# Altium project BG1094_R1M1E1.PrjPcb (part 1 of 2)
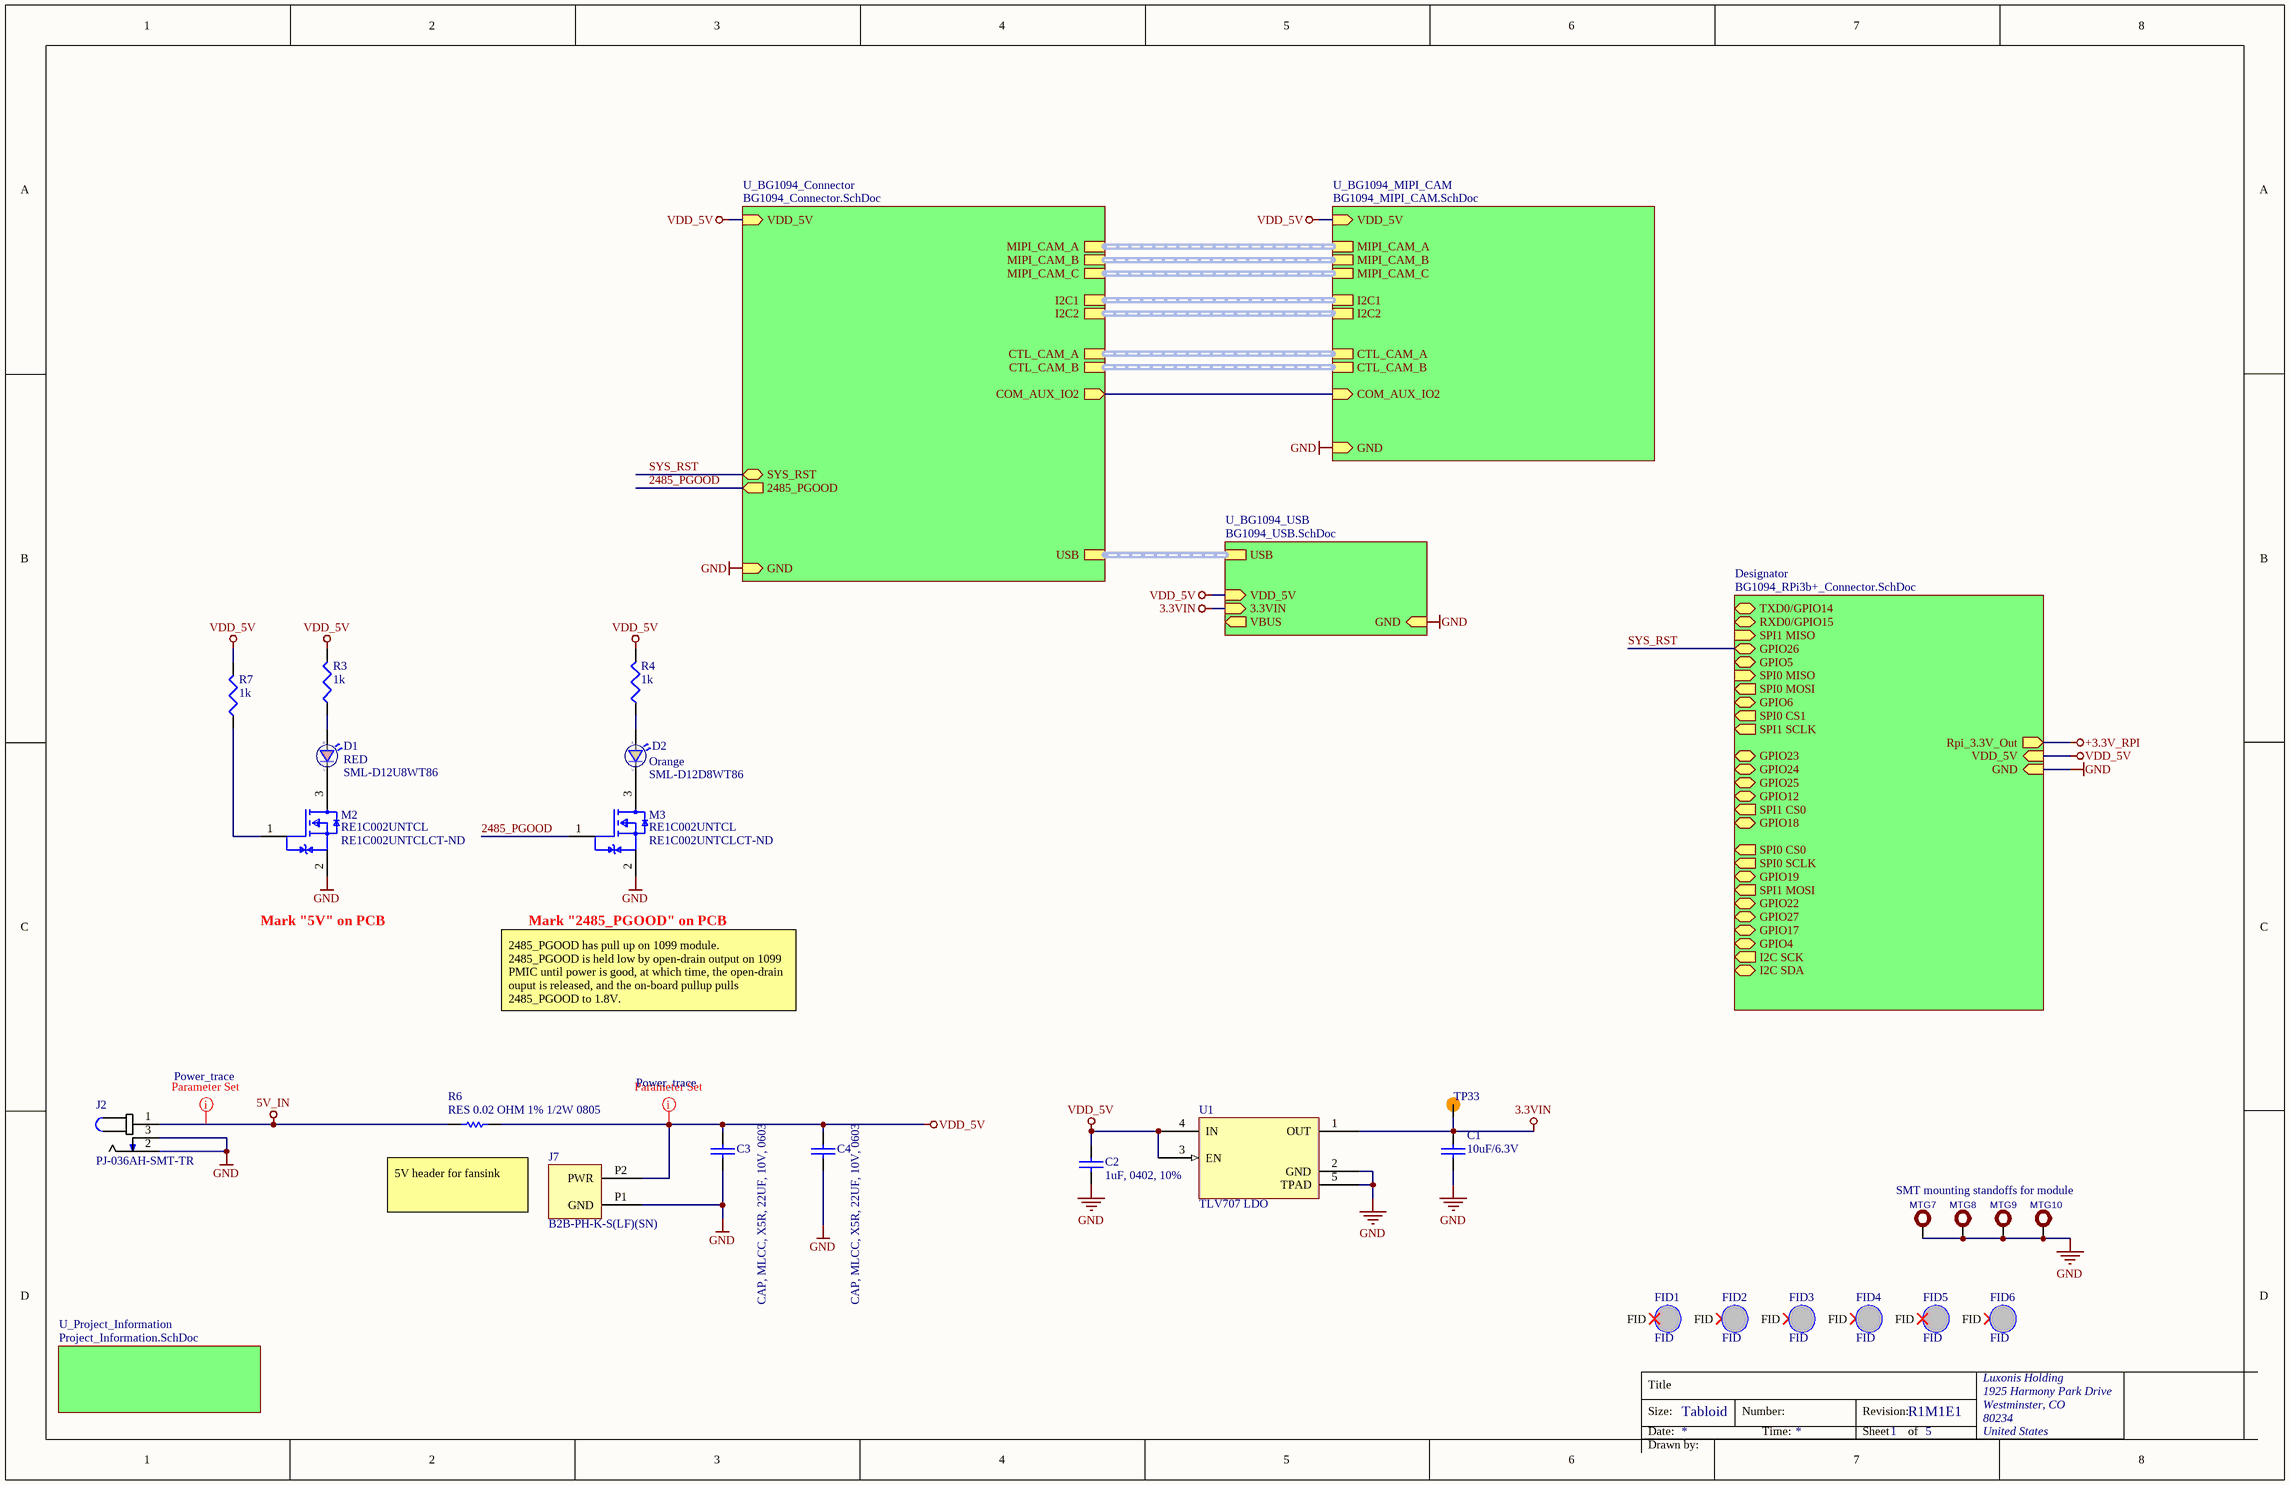
[diagram p0: BG1094_TopLevel.SchDoc]
document_number: D0000194; drawn_by: Brian Weinstein; project_title: BW1094; revision: R1M1E1
6 sheets, 84 parts. Net scope: strictly hierarchical (ports join the sheet entries above them; power ports are local).
Board file: BG1094.PcbDoc
Sheets:
  BG1094_TopLevel.SchDoc
    U_BG1094_Connector = BG1094_Connector.SchDoc
    U_BG1094_MIPI_CAM = BG1094_MIPI_CAM.SchDoc
    U_BG1094_USB = BG1094_USB.SchDoc
    Designator = BG1094_RPi3b+_Connector.SchDoc
    U_Project_Information = Project_Information.SchDoc

## Sheet BG1094_TopLevel.SchDoc: =project_title
size Tabloid; PageSetup: Record=PageOptions|CenterHorizontal=True|CenterVertical=True|PrintScale=0.73|XCorrection=1.00|YCorrection=1.00|PrintKind=0|BorderSize=5000000|LeftOffset=0|BottomOffset=0|Orientation=2|PaperLength=1000|PaperWidth=1000|Scale=100|PaperSource=7|PrintQuality=-4|MediaType=1|DitherType=10|PaperKind=A4|PrintScaleMode=1; CompanyName: Luxonis Holding; DrawnBy: Brian Weinstein; Organization: Luxonis Holding; Address1: 1925 Harmony Park Drive; Address2: Westminster, CO; Address3: 80234; Address4: United States; DocumentNumber: D0000194; Revision: R1M1E1; SheetNumber: 1; SheetTotal: 5

### Parts
C1  10uF/6.3V  [CAPC0402(1005)70_N]
C2  1uF, 0402, 10%  [CAPC0402(1005)70_N]
C3  CAP, MLCC, X5R, 22UF, 10V, 0603  [CAPC0603(1608)100_N]
C4  CAP, MLCC, X5R, 22UF, 10V, 0603  [CAPC0603(1608)100_N]
D1  RED  Manufacturer Part Number 1: SML-D12U8WT86  [LED_0603]
D2  SML-D12D8WT86  Color: Orange  [LED_0603]
FID1  FID  [FIDUCIAL_1MM]  (no BOM)
FID2  FID  [FIDUCIAL_1MM]  (no BOM)
FID3  FID  [FIDUCIAL_1MM]  (no BOM)
FID4  FID  [FIDUCIAL_1MM]  (no BOM)
FID5  FID  [FIDUCIAL_1MM]  (no BOM)
FID6  FID  [FIDUCIAL_1MM]  (no BOM)
J2  PJ-036AH-SMT-TR  [CUI_PJ-036AH-SMT-TR]
J7  B2B-PH-K-S(LF)(SN)  [*JST_B2B-PH-K-S(LF)(SN)]
M2  RE1C002UNTCL  Supplier Part Number 1: RE1C002UNTCLCT-ND  [SOT-416FL]
M3  RE1C002UNTCL  Supplier Part Number 1: RE1C002UNTCLCT-ND  [SOT-416FL]
MTG7  MTG-HOLE  [STANDOFF_M2X0.4_3MM]  (value not drawn)
MTG8  MTG-HOLE  [STANDOFF_M2X0.4_3MM]  (value not drawn)
MTG9  MTG-HOLE  [STANDOFF_M2X0.4_3MM]  (value not drawn)
MTG10  MTG-HOLE  [STANDOFF_M2X0.4_3MM]  (value not drawn)
R3  1k  [RESC0402(1005)_N]
R4  1k  [RESC0402(1005)_N]
R6  RES 0.02 OHM 1% 1/2W 0805  [RESC0805(2012)_M]
R7  1k  [RESC0402(1005)_N]
TP33  TP_SMD  [TP_0.75MM_SMD_NO-SILK]  (value not drawn)  (no BOM)
U1  TLV707 LDO  [DFN65P100X40-4L]

### Sub-sheets
Designator = BG1094_RPi3b+_Connector.SchDoc: SPI1 MISO (in), GPIO26 (bidir), GPIO5 (bidir), SPI0 MISO (in), SPI0 MOSI (out), GPIO6 (bidir), SPI0 CS1 (out), SPI1 SCLK (out), GPIO23 (bidir), GPIO24 (bidir), GPIO25 (bidir), GPIO12 (bidir), SPI1 CS0 (out), GPIO18 (bidir), SPI0 CS0 (out), SPI0 SCLK (out), GPIO19 (bidir), SPI1 MOSI (out), GPIO22 (bidir), GPIO27 (bidir), GPIO17 (bidir), GPIO4 (bidir), I2C SCK (out), I2C SDA (bidir), Rpi_3.3V_Out (out), VDD_5V (in), GND (in), RXD0/GPIO15 (bidir), TXD0/GPIO14 (bidir)
U_BG1094_Connector = BG1094_Connector.SchDoc: MIPI_CAM_B (harness MIPI_CAM_B), MIPI_CAM_A (harness MIPI_CAM_A), MIPI_CAM_C (harness MIPI_CAM_C), I2C2 (harness I2C2), I2C1 (harness I2C1), SYS_RST (bidir), CTL_CAM_A (harness CTL_CAM_A), CTL_CAM_B (harness CTL_CAM_B), USB (harness USB), GND (in), VDD_5V (in), 2485_PGOOD (out), COM_AUX_IO2 (out)
U_BG1094_MIPI_CAM = BG1094_MIPI_CAM.SchDoc: MIPI_CAM_B (harness MIPI_CAM_B), I2C2 (harness I2C2), I2C1 (harness I2C1), MIPI_CAM_A (harness MIPI_CAM_A), MIPI_CAM_C (harness MIPI_CAM_C), CTL_CAM_A (harness CTL_CAM_A), CTL_CAM_B (harness CTL_CAM_B), GND (in), VDD_5V (in), COM_AUX_IO2 (in)
U_BG1094_USB = BG1094_USB.SchDoc: USB (harness USB), VBUS (out), GND (in), VDD_5V (in), 3.3VIN (in)
U_Project_Information = Project_Information.SchDoc: no entries

### Nets
3.3VIN: C1.2 TP33.1 U1.1(OUT) ; sheet U_BG1094_USB/3.3VIN
5V_IN: J2.1 R6.2
+3.3V_RPI: sheet Designator/Rpi_3.3V_Out
GND: C1.1 C2.2 C3.2 C4.2 J2.2 J2.3 J7.P1(GND) M2.2(Source) M3.2(Source) MTG7.1 MTG8.1 MTG9.1 MTG10.1 U1.2(GND) U1.5(TPAD) ; sheet U_BG1094_Connector/GND, sheet U_BG1094_MIPI_CAM/GND, sheet U_BG1094_USB/GND, sheet Designator/GND
VDD_5V: C2.1 C3.1 C4.1 J7.P2(PWR) R3.2 R4.2 R6.1 R7.2 U1.3(EN) U1.4(IN) ; sheet U_BG1094_Connector/VDD_5V, sheet U_BG1094_MIPI_CAM/VDD_5V, sheet U_BG1094_USB/VDD_5V, sheet Designator/VDD_5V
2485_PGOOD: M3.1(Gate) ; sheet U_BG1094_Connector/2485_PGOOD
COM_AUX_IO2: sheet U_BG1094_Connector/COM_AUX_IO2, sheet U_BG1094_MIPI_CAM/COM_AUX_IO2
SYS_RST: sheet U_BG1094_Connector/SYS_RST, sheet Designator/GPIO26
NetD1_1: D1.1(C) M2.3(Drain)
NetD1_2: D1.2(A) R3.1
NetD2_1: D2.1(C) M3.3(Drain)
NetD2_2: D2.2(A) R4.1
NetM2_1: M2.1(Gate) R7.1

Not connected (* = marked no-connect by the designer): FID1 FID*; FID2 FID*; FID3 FID*; FID4 FID*; FID5 FID*; FID6 FID*

### Buses and harness runs
harness sheet U_BG1094_Connector/CTL_CAM_A = sheet U_BG1094_MIPI_CAM/CTL_CAM_A
harness sheet U_BG1094_Connector/CTL_CAM_B = sheet U_BG1094_MIPI_CAM/CTL_CAM_B
harness sheet U_BG1094_Connector/I2C1 = sheet U_BG1094_MIPI_CAM/I2C1
harness sheet U_BG1094_Connector/I2C2 = sheet U_BG1094_MIPI_CAM/I2C2
harness sheet U_BG1094_Connector/MIPI_CAM_A = sheet U_BG1094_MIPI_CAM/MIPI_CAM_A
harness sheet U_BG1094_Connector/MIPI_CAM_B = sheet U_BG1094_MIPI_CAM/MIPI_CAM_B
harness sheet U_BG1094_Connector/MIPI_CAM_C = sheet U_BG1094_MIPI_CAM/MIPI_CAM_C
harness sheet U_BG1094_Connector/USB = sheet U_BG1094_USB/USB

### Layout directives
net class Power_trace: 5V_IN, VDD_5V

### Notes on the sheet
- Mark "5V" on PCB
- Mark "2485_PGOOD" on PCB
- 2485_PGOOD has pull up on 1099 module. 2485_PGOOD is held low by open-drain output on 1099 PMIC until power is good, at which time, the open-drain ouput is released, and the on-board pullup pulls 2485_PGOOD to 1.8V.
- (near R6) 5V header for fansink
- SMT mounting standoffs for module
- Title
- Size:
- Date:
- Tabloid
- Number:
- Time:
- Revision:
- Sheet
- of
- Drawn by:

### Library data of the parts
C1 = CAP: SMD Multilayer Ceramic Capacitor, 0402 [1005 Metric], 10 µF, 6.3 V, ± 20%, X5R; MAN: MuRata; MAN PN: GRM155R60J106ME44D; ICCO PN: MV226007; DIST: Farnell; DIST PN: 2218854RL
C2 = CL05A105KP5NNNC: Cap Ceramic 1uF 10V X5R 10% SMD 0402 85C Paper T/R; Manufacturer: Samsung; Supplier 1: Digi-Key; Manufacturer Part Number: CL05A105KP5NNNC; Stock 1: 13690251; Pricing 1: 1 = 0.10000, 10 = 0.04200, 100 = 0.01880, 500 = 0.01340, 1000 = 0.01053, 2500 = 0.00958, 5000 = 0.00881 (USD); RoHS: Yes; Mount: Surface Mount; Case/Package: 0402; Case Code (Metric): 1005; Case Code (Imperial): 0402; Material: Ceramic; Contact Plating: Tin; Min Operating Temperature: -55°C; Max Operating Temperature: 85°C; Capacitance: 1uF; Tolerance: 10%; Packaging: Tape and Reel; Voltage Rating: 10V; Dielectric: X5R; Package Quantity: 1; Length: 1mm; Height: 0.5mm; Width: 0.02inch; Thickness: 0.022inch; Depth: 0.5mm; Radiation Hardening: No; ComponentLink1URL: https://datasheet.ciiva.com/15195/getdatasheetpartid-358390-15195630.pdf?src-supplier=Verical; ComponentLink1Description: https://datasheet.ciiva.com/15195/getdatasheetpartid-358390-15195630.pdf?src-supplier=Verical; ComponentLink2URL: https://datasheet.ciiva.com/29198/459159-da-01-en-vs-kondensator-0402-29198341.pdf?src-supplier=Conrad; ComponentLink2Description: https://datasheet.ciiva.com/29198/459159-da-01-en-vs-kondensator-0402-29198341.pdf?src-supplier=Conrad
C3 C4 = GRM188R61A226ME15D: Manufacturer 1: *
D1 = LED_RED_0603: LED RED DIFFUSED 0603 SMD; Manufacturer 1: Rohm; Lens Style: Rectangular,Diffused,Colorless; Forward Current: 20mA; Forward Voltage: 2.2V; Luminous Intensity: 63mcd; Dominant Wavelength: 620nm; Number of LEDs: 1; Viewing Angle: 160°; Lens Color: White,Clear,Diffused; Supplier 1: Digi-Key; Stock 1: 34516; Pricing 1: 1=0.33000, 10=0.23900, 100=0.11340, 500=0.07560, 1000=0.05922 (USD); Mount: Surface Mount; Case/Package: 0603; Number of Pins: 2; Case Code (Metric): 1608; Case Code (Imperial): 0603; Min Operating Temperature: -40°C; Max Operating Temperature: 85°C; Packaging: Tape and Reel; Wavelength: 620nm; Package Quantity: 1; Test Current: 20mA; Lens Transparency: Diffused; Length: 1.6mm; Height: 0.65mm; Width: 0.8mm; Radiation Hardening: No; REACH SVHC: No SVHC; Lead Free: Lead Free; ComponentLink1URL: https://datasheet.ciiva.com/11774/0900766b80df3ada-11774020.pdf?src-supplier=RSComponents; ComponentLink1Description: https://datasheet.ciiva.com/11774/0900766b80df3ada-11774020.pdf?src-supplier=RSComponents; ComponentLink2URL: https://datasheet.ciiva.com/2110/sml-d1-2110375.pdf?src-supplier=Digi-Key; ComponentLink2Description: https://datasheet.ciiva.com/2110/sml-d1-2110375.pdf?src-supplier=Digi-Key; ComponentLink3URL: https://datasheet.ciiva.com/2110/sml-d1-2110376.pdf?src-supplier=Digi-Key; ComponentLink3Description: https://datasheet.ciiva.com/2110/sml-d1-2110376.pdf?src-supplier=Digi-Key; ComponentLink4URL: https://datasheet.ciiva.com/2110/sml-d1-2110377.pdf?src-supplier=Digi-Key; ComponentLink4Description: https://datasheet.ciiva.com/2110/sml-d1-2110377.pdf?src-supplier=Digi-Key; ComponentLink5URL: https://datasheet.ciiva.com/9324/sml-d1-9324826.pdf?src-supplier=Avnet; ComponentLink5Description: https://datasheet.ciiva.com/9324/sml-d1-9324826.pdf?src-supplier=Avnet; RoHS: Yes; Color: Red; Illumination Color: Red; ComponentLink6URL: https://datasheet.ciiva.com/17420/sml-d1-17420939.pdf?src-supplier=Avnet+Europe; ComponentLink6Description: https://datasheet.ciiva.com/17420/sml-d1-17420939.pdf?src-supplier=Avnet+Europe; Supplier Part Number 1: 511-1580-1-ND
D2 = LED_ORANGE_0603: LED ORANGE DIFFUSED 0603 SMD; Manufacturer 1: Rohm; Lens Color: White; Lens Style: Diffused,Colorless,Rectangular; Dominant Wavelength: 605nm; Number of LEDs: 1; Forward Voltage: 2.2V; Viewing Angle: 160°; Forward Current: 20mA; Luminous Intensity: 100mcd; Supplier 1: Digi-Key; Stock 1: 29355; Pricing 1: 1=0.33000, 10=0.23900, 100=0.11340, 500=0.07560, 1000=0.05922 (USD); RoHS: Yes; Mount: Surface Mount; Case/Package: 0603; Number of Pins: 2; Case Code (Metric): 1608; Case Code (Imperial): 0603; Min Operating Temperature: -40°C; Max Operating Temperature: 85°C; Package Quantity: 1; Packaging: Tape and Reel; Illumination Color: Orange; Test Current: 20mA; Lens Transparency: Diffused; Wavelength: 605nm; Length: 1.6mm; Height: 0.65mm; Width: 0.8mm; Radiation Hardening: No; REACH SVHC: Unknown; Lead Free: Lead Free; ComponentLink1URL: https://datasheet.ciiva.com/2115/sml-d1-2115577.pdf?src-supplier=Digi-Key; ComponentLink1Description: https://datasheet.ciiva.com/2115/sml-d1-2115577.pdf?src-supplier=Digi-Key; ComponentLink2URL: https://datasheet.ciiva.com/2115/sml-d1-2115578.pdf?src-supplier=Digi-Key; ComponentLink2Description: https://datasheet.ciiva.com/2115/sml-d1-2115578.pdf?src-supplier=Digi-Key; ComponentLink3URL: https://datasheet.ciiva.com/3161/sml-d1-3161418.pdf?src-supplier=Avnet; ComponentLink3Description: https://datasheet.ciiva.com/3161/sml-d1-3161418.pdf?src-supplier=Avnet; ComponentLink4URL: https://datasheet.ciiva.com/16387/sml-d1-16387850.pdf?src-supplier=Future+Electronics; ComponentLink4Description: https://datasheet.ciiva.com/16387/sml-d1-16387850.pdf?src-supplier=Future+Electronics; ComponentLink5URL: https://datasheet.ciiva.com/2115/sml-d1-2115579.pdf?src-supplier=Digi-Key; ComponentLink5Description: https://datasheet.ciiva.com/2115/sml-d1-2115579.pdf?src-supplier=Digi-Key; ComponentLink6URL: https://datasheet.ciiva.com/17419/sml-d1-17419886.pdf?src-supplier=Avnet+Europe; ComponentLink6Description: https://datasheet.ciiva.com/17419/sml-d1-17419886.pdf?src-supplier=Avnet+Europe; Supplier Part Number 1: 511-1577-1-ND; Manufacturer Part Number 1: SML-D12D8WT86
FID1-FID6 = FID: Fiducial mark; MAN PN: No part on PCB; MAN: Fiducial
J2 = PJ-036AH-SMT-TR: 2.0 x 6.3 mm, 5.0 A, Horizontal, Surface Mount (SMT), Dc Power Jack Connector; Manufacturer 1: CUI; Current Rating: 5A; Gender: Male; Shielding: Unshielded; Voltage Rating: 24V; Insulation Resistance: 100MR; Number of Conductors: 2; Supplier 1: Digi-Key; Manufacturer Part Number 1: PJ-036AH-SMT-TR; Stock 1: 14194; Pricing 1: 1=1.39000, 10=1.26100, 25=1.18400, 50=1.13260, 100=1.08110 (USD); RoHS: Yes; Mount: Surface Mount; Case/Package: SMD/SMT; Color: Black; Contact Material: Brass; Contact Plating: Silver; Housing Color: Black; Housing Material: Thermoplastic; Min Operating Temperature: -25°C; Max Operating Temperature: 85°C; Package Quantity: 1000; Termination: SMD/SMT; Connector Type: Jack; Contact Gender: Male; Packaging: Tape and Reel; Orientation: Horizontal; Lead Free: Lead Free; Flammability Rating: UL94 V-0; ComponentLink1URL: http://www.mouser.com/ds/2/670/pj-036ah-smt-516063.pdf?src-supplier=Mouser; ComponentLink1Description: http://www.mouser.com/ds/2/670/pj-036ah-smt-516063.pdf?src-supplier=Mouser; ComponentLink2URL: http://www.cui.com/Product/Resource/FuturePDF/PJ-036AH-SMT.pdf?src-supplier=Future+Electronics; ComponentLink2Description: http://www.cui.com/Product/Resource/FuturePDF/PJ-036AH-SMT.pdf?src-supplier=Future+Electronics; ComponentLink3URL: https://www.cui.com/product/resource/digikeypdf/pj-036ah-smt-tr.pdf?src-supplier=Digi-Key; ComponentLink3Description: https://www.cui.com/product/resource/digikeypdf/pj-036ah-smt-tr.pdf?src-supplier=Digi-Key; Supplier Part Number 1: CP-036AHPJCT-ND
J7 = B2B-PH-K-S(LF)(SN): CONN HEADER VERT 2POS 2MM; Manufacturer: JST; Number of Positions: 2; Connector Type: Male Pin; Current Rating: 2A; Gender: Male; Contact Resistance: 20mR; Insulation Resistance: 1MR; Voltage Rating: 100V; Supplier 1: Digi-Key; Manufacturer Part Number: B2B-PH-K-S(LF)(SN); Stock 1: 216199; Pricing 1: 1 = 0.170000, 10 = 0.162000, 100 = 0.100200, 500 = 0.082880, 1000 = 0.072520, 5000 = 0.062160, 10000 = 0.060440 (USD); RoHS: Yes; Mount: Through Hole; Number of Pins: 2; Contact Plating: Tin; Color: Natural; Contact Material: Brass; Housing Material: Polyamide; Housing Color: White; Min Operating Temperature: -25°C; Max Operating Temperature: 85°C; Number of Rows: 1; Packaging: Bulk; Termination: Solder; Fastening Type: Detent; Number of Poles: 2; Number of Contacts: 2; Orientation: Straight; Max Current Rating: 2A; Max Voltage Rating (AC): 100V; Voltage Rating (AC): 100V; Working Voltage: 100V; Max Voltage Rating (DC): 100V; Length: 5.9mm; Height: 9.4mm; Pitch: 2mm; Width: 4.5mm; Contact Mating Length: 0.13inch; Depth: 4.5mm; Lead Pitch: 2mm; Lead Free: Lead Free; REACH SVHC: No SVHC; ComponentLink1URL: https://datasheet.ciiva.com/6747/80560-6747392.pdf?src-supplier=Newark; ComponentLink1Description: https://datasheet.ciiva.com/6747/80560-6747392.pdf?src-supplier=Newark; ComponentLink2URL: https://datasheet.ciiva.com/11746/0900766b8082f551-11746676.pdf?src-supplier=RSComponents; ComponentLink2Description: https://datasheet.ciiva.com/11746/0900766b8082f551-11746676.pdf?src-supplier=RSComponents; ComponentLink3URL: https://datasheet.ciiva.com/8052/80560-8052022.pdf?src-supplier=Element14; ComponentLink3Description: https://datasheet.ciiva.com/8052/80560-8052022.pdf?src-supplier=Element14; ComponentLink4URL: https://datasheet.ciiva.com/712/eph-712442.pdf?src-supplier=Digi-Key; ComponentLink4Description: https://datasheet.ciiva.com/712/eph-712442.pdf?src-supplier=Digi-Key; ComponentLink5URL: https://datasheet.ciiva.com/16422/b2b-ph-k-slfsn-16422715.pdf?src-supplier=Future+Electronics; ComponentLink5Description: https://datasheet.ciiva.com/16422/b2b-ph-k-slfsn-16422715.pdf?src-supplier=Future+Electronics; Supplier Part Number 1: 455-1704-ND
M2 M3 = RE1C002UNTCL: MOSFET N-CH 20V 0.2A EMT3; Manufacturer 1: Rohm; Continuous Drain Current (ID): 200mA; Rds On Max: 1.2R; Input Capacitance: 25pF; Max Power Dissipation: 150mW; Supplier 1: Digi-Key; Manufacturer Part Number 1: RE1C002UNTCL; Stock 1: 941425; Pricing 1: 1=0.20000, 10=0.18200, 100=0.09930, 500=0.06112, 1000=0.04167 (USD); RoHS: Yes; Mount: Surface Mount; Case/Package: SOT-89; Packaging: Tape and Reel; Drain to Source Voltage (Vdss): 20V; Lead Free: Lead Free; ComponentLink1URL: http://www.mouser.com/ds/2/348/re1c002untcl-e-1018231.pdf?src-supplier=Mouser; ComponentLink1Description: http://www.mouser.com/ds/2/348/re1c002untcl-e-1018231.pdf?src-supplier=Mouser; ComponentLink2URL: http://rohmfs.rohm.com/en/techdata_basic/transistor/taping/EMT3_TL_taping.pdf?src-supplier=Digi-Key; ComponentLink2Description: http://rohmfs.rohm.com/en/techdata_basic/transistor/taping/EMT3_TL_taping.pdf?src-supplier=Digi-Key; ComponentLink3URL: http://rohmfs.rohm.com/en/products/databook/datasheet/discrete/transistor/mosfet/re1c002un.pdf?src-supplier=Avnet; ComponentLink3Description: http://rohmfs.rohm.com/en/products/databook/datasheet/discrete/transistor/mosfet/re1c002un.pdf?src-supplier=Avnet; ComponentLink4URL: https://www.rohm.com/datasheet/RE1C002UN/re1c002untcl-e?src-supplier=Digi-Key; ComponentLink4Description: https://www.rohm.com/datasheet/RE1C002UN/re1c002untcl-e?src-supplier=Digi-Key; ComponentLink5URL: http://www.farnell.com/datasheets/2704376.pdf?src-supplier=Newark; ComponentLink5Description: http://www.farnell.com/datasheets/2704376.pdf?src-supplier=Newark
MTG7-MTG10 = MTG-HOLE_B: Mounting Hole; B - Value: Not a Part; A - Level: 0; Z - SMD or PTH: PTH; F - MFG P/N: Not a Part; D - my Footprint: STANDOFF_M2X0.4_3MM
R3 R4 R7 = RES1: SMD Chip Resistor, 1 kohm, 50 V, 0402 [1005 Metric], 62.5 mW, ± 1%
R6 = D-100-0004
TP33 = TP_SMD: circular pad test point, SMD
U1 = TLV707: IC REG LDO 1V 0.2A 4X2SON; Manufacturer: Texas Instruments; Manufacturer Part Number: TLV70710DQNR; Output Current: 200mA; Number of Regulators: 1; Min Current Limit: 240mA; Quiescent Current: 25uA; Dropout Voltage: 250mV; Supplier 1: Digi-Key; Stock 1: 4380; Pricing 1: 1 = 0.46000, 10 = 0.37300, 100 = 0.25380, 500 = 0.19034, 1000 = 0.14276 (USD); RoHS: Yes; Mount: Surface Mount; Min Operating Temperature: -40°C; Max Operating Temperature: 125°C; Packaging: Tape and Reel; Package Quantity: 3000; Output Voltage: 1V; Lead Free: Lead Free; ComponentLink1URL: http://www.ti.com/lit/gpn/tlv707?src-supplier=Mouser; ComponentLink1Description: http://www.ti.com/lit/gpn/tlv707?src-supplier=Mouser; ComponentLink2URL: http://www.ti.com/lit/ds/symlink/tlv707.pdf?src-supplier=Digi-Key; ComponentLink2Description: http://www.ti.com/lit/ds/symlink/tlv707.pdf?src-supplier=Digi-Key

## Sheet BG1094_Connector.SchDoc: =project_title
size Tabloid; CompanyName: Luxonis Holding; DrawnBy: Brian Weinstein; Organization: Luxonis Holding; Address1: 1925 Harmony Park Drive; Address2: Westminster, CO; Address3: 80234; Address4: United States; DocumentNumber: D0000194; Revision: R1M1E1; SheetNumber: 3; SheetTotal: 5
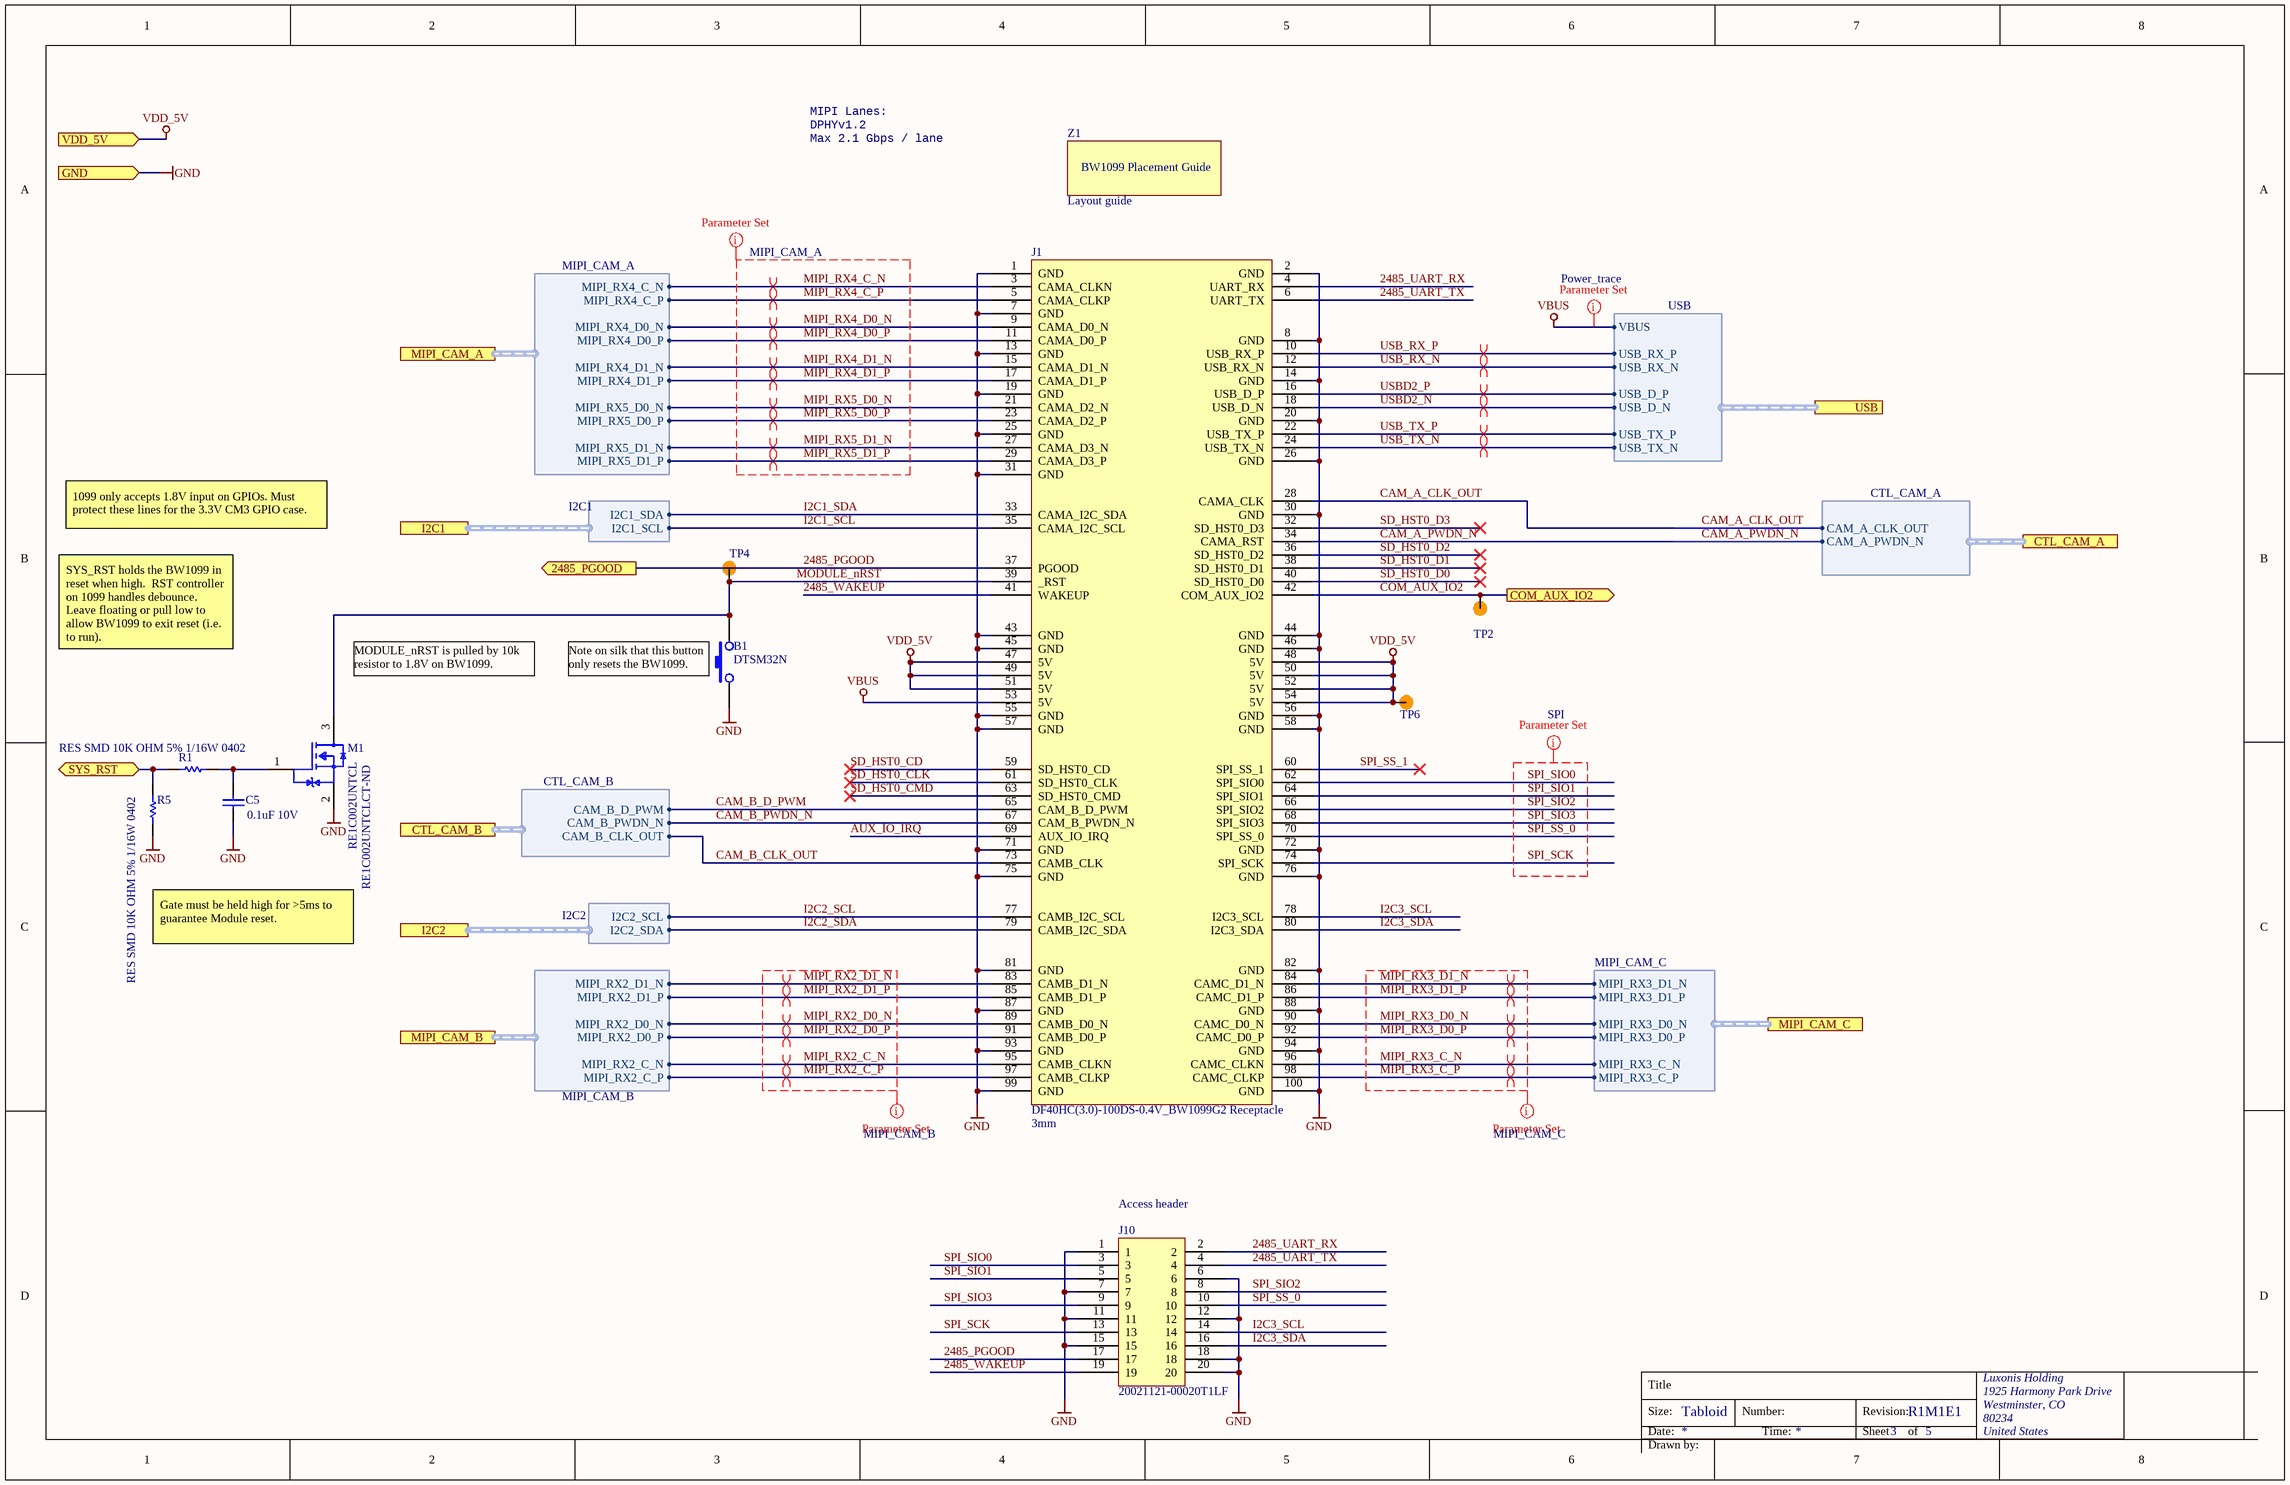
[diagram p1: BG1094_Connector.SchDoc]

### Parts
B1  DTSM32N  [DTSM32N]
C5  0.1uF 10V  [CAPC0402(1005)70_N]
J1  DF40HC(3.0)-100DS-0.4V_BW1099G2 Receptacle  Mated Stacking Height: 3mm  [DF40HC-3.0-100DS-0.4V_minpad]
J10  20021121-00020T1LF  [20021121-00020T1LF]
M1  RE1C002UNTCL  Supplier Part Number 1: RE1C002UNTCLCT-ND  [SOT-416FL]
R1  RES SMD 10K OHM 5% 1/16W 0402  [RESC0402(1005)_N]
R5  RES SMD 10K OHM 5% 1/16W 0402  [RESC0402(1005)_N]
TP2  TP100_200_NS  [TP100_200_NS]  (value not drawn)  (no BOM)
TP4  TP_SMD  [TP_0.75MM_SMD_NO-SILK]  (value not drawn)  (no BOM)
TP6  TP_SMD  [TP_0.75MM_SMD_NO-SILK]  (value not drawn)  (no BOM)
Z1  Layout guide  [BW1099_Footprint]  (no BOM)

### Ports
2485_PGOOD (out), COM_AUX_IO2 (out), CTL_CAM_A (harness CTL_CAM_A), CTL_CAM_B (harness CTL_CAM_B), GND (in), I2C1 (harness I2C1), I2C2 (harness I2C2), MIPI_CAM_A (harness MIPI_CAM_A), MIPI_CAM_B (harness MIPI_CAM_B), MIPI_CAM_C (harness MIPI_CAM_C), SYS_RST (bidir), USB (harness USB), VDD_5V (in)

### Harnesses
MIPI_CAM_B: MIPI_RX2_C_P, MIPI_RX2_C_N, MIPI_RX2_D0_P, MIPI_RX2_D0_N, MIPI_RX2_D1_P, MIPI_RX2_D1_N
MIPI_CAM_A: MIPI_RX4_C_P, MIPI_RX4_C_N, MIPI_RX4_D0_P, MIPI_RX4_D0_N, MIPI_RX4_D1_P, MIPI_RX4_D1_N, MIPI_RX5_D0_P, MIPI_RX5_D0_N, MIPI_RX5_D1_P, MIPI_RX5_D1_N
MIPI_CAM_C: MIPI_RX3_C_P, MIPI_RX3_C_N, MIPI_RX3_D0_P, MIPI_RX3_D0_N, MIPI_RX3_D1_P, MIPI_RX3_D1_N
I2C2: I2C2_SDA, I2C2_SCL
I2C1: I2C1_SDA, I2C1_SCL
USB: USB_D_P, USB_D_N, USB_TX_N, USB_TX_P, USB_RX_N, USB_RX_P, VBUS
CTL_CAM_A: CAM_A_PWDN_N, CAM_A_CLK_OUT
CTL_CAM_B: CAM_B_CLK_OUT, CAM_B_PWDN_N, CAM_B_D_PWM

### Nets
GND: B1.1 C5.1 J1.1(GND) J1.2(GND) J1.7(GND) J1.8(GND) J1.13(GND) J1.14(GND) J1.19(GND) J1.20(GND) J1.25(GND) J1.26(GND) J1.30(GND) J1.31(GND) J1.43(GND) J1.44(GND) J1.45(GND) J1.46(GND) J1.55(GND) J1.56(GND) J1.57(GND) J1.58(GND) J1.71(GND) J1.72(GND) J1.75(GND) J1.76(GND) J1.81(GND) J1.82(GND) J1.87(GND) J1.88(GND) J1.93(GND) J1.94(GND) J1.99(GND) J1.100(GND) J10.1 J10.6 J10.7 J10.11 J10.12 J10.15 J10.18 J10.20 M1.2(Source) R5.1 ; port GND
VBUS: J1.53(5V) ; port USB.VBUS
VDD_5V: J1.47(5V) J1.48(5V) J1.49(5V) J1.50(5V) J1.51(5V) J1.52(5V) J1.54(5V) TP6.1 ; port VDD_5V
2485_PGOOD: J1.37(PGOOD) J10.17 ; port 2485_PGOOD
2485_UART_RX: J1.4(UART_RX) J10.2
2485_UART_TX: J1.6(UART_TX) J10.4
2485_WAKEUP: J1.41(WAKEUP) J10.19
AUX_IO_IRQ: J1.69(AUX_IO_IRQ)
CAM_A_CLK_OUT: J1.28(CAMA_CLK) ; port CTL_CAM_A.CAM_A_CLK_OUT
CAM_A_PWDN_N: J1.34(CAMA_RST) ; port CTL_CAM_A.CAM_A_PWDN_N
CAM_B_CLK_OUT: J1.73(CAMB_CLK) ; port CTL_CAM_B.CAM_B_CLK_OUT
CAM_B_D_PWM: J1.65(CAM_B_D_PWM) ; port CTL_CAM_B.CAM_B_D_PWM
CAM_B_PWDN_N: J1.67(CAM_B_PWDN_N) ; port CTL_CAM_B.CAM_B_PWDN_N
COM_AUX_IO2: J1.42(COM_AUX_IO2) TP2.1 ; port COM_AUX_IO2
I2C1_SCL: J1.35(CAMA_I2C_SCL) ; port I2C1.I2C1_SCL
I2C1_SDA: J1.33(CAMA_I2C_SDA) ; port I2C1.I2C1_SDA
I2C2_SCL: J1.77(CAMB_I2C_SCL) ; port I2C2.I2C2_SCL
I2C2_SDA: J1.79(CAMB_I2C_SDA) ; port I2C2.I2C2_SDA
I2C3_SCL: J1.78(I2C3_SCL) J10.14
I2C3_SDA: J1.80(I2C3_SDA) J10.16
MIPI_RX2_C_N: J1.95(CAMB_CLKN) ; port MIPI_CAM_B.MIPI_RX2_C_N  [project net CAM_L_C_N]
MIPI_RX2_C_P: J1.97(CAMB_CLKP) ; port MIPI_CAM_B.MIPI_RX2_C_P  [project net CAM_L_C_P]
MIPI_RX2_D0_N: J1.89(CAMB_D0_N) ; port MIPI_CAM_B.MIPI_RX2_D0_N  [project net CAM_L_D0_N]
MIPI_RX2_D0_P: J1.91(CAMB_D0_P) ; port MIPI_CAM_B.MIPI_RX2_D0_P  [project net CAM_L_D0_P]
MIPI_RX2_D1_N: J1.83(CAMB_D1_N) ; port MIPI_CAM_B.MIPI_RX2_D1_N  [project net CAM_L_D1_N]
MIPI_RX2_D1_P: J1.85(CAMB_D1_P) ; port MIPI_CAM_B.MIPI_RX2_D1_P  [project net CAM_L_D1_P]
MIPI_RX3_C_N: J1.96(CAMC_CLKN) ; port MIPI_CAM_C.MIPI_RX3_C_N  [project net CAM_R_C_N]
MIPI_RX3_C_P: J1.98(CAMC_CLKP) ; port MIPI_CAM_C.MIPI_RX3_C_P  [project net CAM_R_C_P]
MIPI_RX3_D0_N: J1.90(CAMC_D0_N) ; port MIPI_CAM_C.MIPI_RX3_D0_N  [project net CAM_R_D0_N]
MIPI_RX3_D0_P: J1.92(CAMC_D0_P) ; port MIPI_CAM_C.MIPI_RX3_D0_P  [project net CAM_R_D0_P]
MIPI_RX3_D1_N: J1.84(CAMC_D1_N) ; port MIPI_CAM_C.MIPI_RX3_D1_N  [project net CAM_R_D1_N]
MIPI_RX3_D1_P: J1.86(CAMC_D1_P) ; port MIPI_CAM_C.MIPI_RX3_D1_P  [project net CAM_R_D1_P]
MIPI_RX4_C_N: J1.3(CAMA_CLKN) ; port MIPI_CAM_A.MIPI_RX4_C_N  [project net MIPI_C_N]
MIPI_RX4_C_P: J1.5(CAMA_CLKP) ; port MIPI_CAM_A.MIPI_RX4_C_P  [project net MIPI_C_P]
MIPI_RX4_D0_N: J1.9(CAMA_D0_N) ; port MIPI_CAM_A.MIPI_RX4_D0_N  [project net MIPI_D0_N]
MIPI_RX4_D0_P: J1.11(CAMA_D0_P) ; port MIPI_CAM_A.MIPI_RX4_D0_P  [project net MIPI_D0_P]
MIPI_RX4_D1_N: J1.15(CAMA_D1_N) ; port MIPI_CAM_A.MIPI_RX4_D1_N  [project net MIPI_D1_N]
MIPI_RX4_D1_P: J1.17(CAMA_D1_P) ; port MIPI_CAM_A.MIPI_RX4_D1_P  [project net MIPI_D1_P]
MIPI_RX5_D0_N: J1.21(CAMA_D2_N) ; port MIPI_CAM_A.MIPI_RX5_D0_N  [project net MIPI_D2_N]
MIPI_RX5_D0_P: J1.23(CAMA_D2_P) ; port MIPI_CAM_A.MIPI_RX5_D0_P  [project net MIPI_D2_P]
MIPI_RX5_D1_N: J1.27(CAMA_D3_N) ; port MIPI_CAM_A.MIPI_RX5_D1_N  [project net MIPI_D3_N]
MIPI_RX5_D1_P: J1.29(CAMA_D3_P) ; port MIPI_CAM_A.MIPI_RX5_D1_P  [project net MIPI_D3_P]
MODULE_nRST: B1.2 J1.39(_RST) M1.3(Drain) TP4.1
SD_HST0_CD: J1.59(SD_HST0_CD)
SD_HST0_CLK: J1.61(SD_HST0_CLK)
SD_HST0_CMD: J1.63(SD_HST0_CMD)
SD_HST0_D0: J1.40(SD_HST0_D0)
SD_HST0_D1: J1.38(SD_HST0_D1)
SD_HST0_D2: J1.36(SD_HST0_D2)
SD_HST0_D3: J1.32(SD_HST0_D3)
SPI_SCK: J1.74(SPI_SCK) J10.13
SPI_SIO0: J1.62(SPI_SIO0) J10.3
SPI_SIO1: J1.64(SPI_SIO1) J10.5
SPI_SIO2: J1.66(SPI_SIO2) J10.8
SPI_SIO3: J1.68(SPI_SIO3) J10.9
SPI_SS_0: J1.70(SPI_SS_0) J10.10
SPI_SS_1: J1.60(SPI_SS_1)
SYS_RST: R1.2 R5.2 ; port SYS_RST
USB_RX_N: J1.12(USB_RX_N) ; port USB.USB_RX_N
USB_RX_P: J1.10(USB_RX_P) ; port USB.USB_RX_P
USB_TX_N: J1.24(USB_TX_N) ; port USB.USB_TX_N
USB_TX_P: J1.22(USB_TX_P) ; port USB.USB_TX_P
USBD2_N: J1.18(USB_D_N) ; port USB.USB_D_N  [project net USB_D_N]
USBD2_P: J1.16(USB_D_P) ; port USB.USB_D_P  [project net USB_D_P]
NetC5_2: C5.2 M1.1(Gate) R1.1

### Layout directives
net class MIPI_CAM_C; rule Matched Net Lengths [Tolerance = 5mil]: MIPI_RX3_C_N, MIPI_RX3_C_P, MIPI_RX3_D0_N, MIPI_RX3_D0_P, MIPI_RX3_D1_N, MIPI_RX3_D1_P
net class MIPI_CAM_A; rule Matched Net Lengths [Tolerance = 5mil]: MIPI_RX4_C_N, MIPI_RX4_C_P, MIPI_RX4_D0_N, MIPI_RX4_D0_P, MIPI_RX4_D1_N, MIPI_RX4_D1_P, MIPI_RX5_D0_N, MIPI_RX5_D0_P, MIPI_RX5_D1_N, MIPI_RX5_D1_P
net class MIPI_CAM_B; rule Matched Net Lengths [Tolerance = 5mil]: MIPI_RX2_C_N, MIPI_RX2_C_P, MIPI_RX2_D0_N, MIPI_RX2_D0_P, MIPI_RX2_D1_N, MIPI_RX2_D1_P
differential pair; differential pair class 100ohm: CAM_L_C_N, CAM_L_C_P, CAM_L_D0_N, CAM_L_D0_P, CAM_L_D1_N, CAM_L_D1_P, CAM_R_C_N, CAM_R_C_P, CAM_R_D0_N, CAM_R_D0_P, CAM_R_D1_N, CAM_R_D1_P, MIPI_C_N, MIPI_C_P, MIPI_D0_N, MIPI_D0_P, MIPI_D1_N, MIPI_D1_P, MIPI_D2_N, MIPI_D2_P, MIPI_D3_N, MIPI_D3_P
differential pair; differential pair class 90ohm: USB_D_N, USB_D_P, USB_RX_N, USB_RX_P, USB_TX_N, USB_TX_P
net class Power_trace: VBUS
net class SPI; rule Matched Net Lengths [Tolerance = 100mil]: SPI_SCK, SPI_SIO0, SPI_SIO1, SPI_SIO2, SPI_SIO3, SPI_SS_0

### Notes on the sheet
- MIPI Lanes:
- Max 2.1 Gbps / lane
- DPHYv1.2
- 1099 only accepts 1.8V input on GPIOs. Must protect these lines for the 3.3V CM3 GPIO case.
- SYS_RST holds the BW1099 in reset when high.  RST controller on 1099 handles debounce.  Leave floating or pull low to allow BW1099 to exit reset (i.e. to run).
- MODULE_nRST is pulled by 10k resistor to 1.8V on BW1099.
- (near B1) Note on silk that this button only resets the BW1099.
- Gate must be held high for >5ms to guarantee Module reset.
- (near J10) Access header
- Title
- Size:
- Date:
- Tabloid
- Number:
- Time:
- Revision:
- Sheet
- of
- Drawn by:
- (in symbol BW1099_Footprint) BW1099 Placement Guide

### Library data of the parts
B1 = SW-PB: Tact Switch; MAN: Wurth; MAN PN: 434 113 050 826; DIST: Farnell; DIST PN: 1868029; ICCO PN: M1V00020
C5 = !CAP: 0.1uF 10V X7R 10% Pad SMD 0402 125C T/R; Manufacturer 1: Murata; Manufacturer Part Number 1: GRM155R71A104KA01D; Capacitance: 100nF; Dissipation Factor: 0.035%; Supplier 1: Digi-Key; Supplier Part Number 1: 490-6321-1-ND; Stock 1: 6982387; Pricing 1: 1=0.10000, 10=0.03400, 100=0.01500, 500=0.01074, 1000=0.00844, 2500=0.00768, 5000=0.00706 (USD); RoHS: Yes; Mount: Surface Mount; Case/Package: 0402; Number of Pins: 2; Case Code (Metric): 1005; Case Code (Imperial): 0402; Min Operating Temperature: -55°C; Max Operating Temperature: 125°C; Voltage Rating: 10V; Tolerance: 10%; Packaging: Tape and Reel; Voltage Rating (DC): 10V; Dielectric: X7R; Package Quantity: 1; Termination: SMD/SMT; Voltage: 10V; Length: 1mm; Height: 0.5mm; Width: 0.02inch; Depth: 0.5mm; Thickness: 0.022inch; Radiation Hardening: No; REACH SVHC: No SVHC; Lead Free: Lead Free; ComponentLink1URL: https://datasheet.ciiva.com/18184/getdatasheetpartid-130330-18184636.pdf?src-supplier=Verical; ComponentLink1Description: https://datasheet.ciiva.com/18184/getdatasheetpartid-130330-18184636.pdf?src-supplier=Verical; ComponentLink2URL: https://datasheet.ciiva.com/7937/1747441-7937613.pdf?src-supplier=Element14; ComponentLink2Description: https://datasheet.ciiva.com/7937/1747441-7937613.pdf?src-supplier=Element14; ComponentLink3URL: https://datasheet.ciiva.com/6271/product-6271137.pdf?src-supplier=Digi-Key; ComponentLink3Description: https://datasheet.ciiva.com/6271/product-6271137.pdf?src-supplier=Digi-Key; ComponentLink4URL: https://datasheet.ciiva.com/11789/0900766b80ef921d-11789061.pdf?src-supplier=RSComponents; ComponentLink4Description: https://datasheet.ciiva.com/11789/0900766b80ef921d-11789061.pdf?src-supplier=RSComponents; ComponentLink5URL: https://datasheet.ciiva.com/19475/1856345-19475961.pdf?src-supplier=Jameco; ComponentLink5Description: https://datasheet.ciiva.com/19475/1856345-19475961.pdf?src-supplier=Jameco; ComponentLink6URL: https://datasheet.ciiva.com/16199/c02e-16199258.pdf?src-supplier=Future+Electronics; ComponentLink6Description: https://datasheet.ciiva.com/16199/c02e-16199258.pdf?src-supplier=Future+Electronics; ComponentLink7URL: https://datasheet.ciiva.com/6271/partnumbering-e-01-6271135.pdf?src-supplier=Digi-Key; ComponentLink7Description: https://datasheet.ciiva.com/6271/partnumbering-e-01-6271135.pdf?src-supplier=Digi-Key
J1 = DF40HC(3.0)-100DS-0.4V_BW1099_G2: CONN RCPT 100POS 0.4MM SMD GOLD; Manufacturer 1: Hirose; Manufacturer Part Number 1: DF40HC(3.0)-100DS-0.4V(51; Number of Positions: 100; Pitch: 0.016inch; RoHS: Yes; Mount: Surface Mount; Contact Plating: Gold; Packaging: Tape and Reel; Number of Rows: 2; Package Quantity: 1000; Connector Type: Receptacle; Lead Free: Lead Free; ComponentLink1URL: https://datasheet.ciiva.com/46636/ed-df40-20140305-46636517.pdf?src-supplier=Digi-Key; ComponentLink1Description: https://datasheet.ciiva.com/46636/ed-df40-20140305-46636517.pdf?src-supplier=Digi-Key; ComponentLink2URL: https://datasheet.ciiva.com/18562/ed-df40-20140305-18562189.pdf?src-supplier=Digi-Key; ComponentLink2Description: https://datasheet.ciiva.com/18562/ed-df40-20140305-18562189.pdf?src-supplier=Digi-Key; ComponentLink3URL: https://datasheet.ciiva.com/13559/ed-df40-20140305-13559540.pdf?src-supplier=Mouser; ComponentLink3Description: https://datasheet.ciiva.com/13559/ed-df40-20140305-13559540.pdf?src-supplier=Mouser; ComponentLink4URL: https://datasheet.ciiva.com/18562/ed-df40-20140305-18562462.pdf?src-supplier=Digi-Key; ComponentLink4Description: https://datasheet.ciiva.com/18562/ed-df40-20140305-18562462.pdf?src-supplier=Digi-Key; Supplier 1: Mouser; Stock 1: 2172; Pricing 1: 1=2.54000, 10=2.26000, 25=2.07000, 50=2.07000, 100=1.98000, 250=1.79000, 500=1.65000, 1000=1.41000, 3000=1.32000, 6000=1.23000, 10000=1.23000 (USD); Supplier 2: Mouser; Manufacturer 2: Hirose; Manufacturer Part Number 2: DF40HC(3.0)-100DS-0.4V(58); Stock 2: 2078; Pricing 2: 1=2.50000, 10=2.40000, 25=2.10000, 50=2.10000, 100=2.00000, 250=1.76000, 500=1.71000, 1000=1.45000, 2000=1.36000, 5000=1.31000, 10000=1.31000 (USD); Supplier Part Number 1: 798-DF40HC30100DS451; Supplier Part Number 2: 798-DF40HC30100DS458
J10 = 20021121-00020T1LF: Conn Unshrouded Header HDR 20 POS 1.27mm Solder ST SMD Tube; Manufacturer 1: Amphenol FCI; Contact Resistance: 30mR; Number of Positions: 20; Max Voltage Rating (AC): 125V; Connector Type: Male Pin; Row Spacing: 0.05inch; Supplier 1: Avnet; Manufacturer Part Number 1: 20021121-00020T1LF; Stock 1: 0; Pricing 1: 1840=0.65487, 3680=0.63909, 7360=0.62487, 11040=0.61127, 18400=0.60354 (USD); RoHS: Yes; Mount: Surface Mount; Contact Plating: Gold; Contact Material: Copper Alloy; Color: Black; Housing Color: Black; Housing Material: Thermoplastic; Min Operating Temperature: -40°C; Max Operating Temperature: 85°C; Packaging: Rail/Tube; Package Quantity: 46; Number of Rows: 2; Termination: Solder; Number of Contacts: 20; Orientation: Straight; Length: 12.7mm; Pitch: 1.27mm; Contact Mating Length: 0.12inch; Depth: 3.4mm; ComponentLink1URL: https://datasheet.ciiva.com/18660/20021121-18660311.pdf?src-supplier=Digi-Key; ComponentLink1Description: https://datasheet.ciiva.com/18660/20021121-18660311.pdf?src-supplier=Digi-Key; ComponentLink2URL: https://datasheet.ciiva.com/10033/20021121-10033355.pdf?src-supplier=Avnet; ComponentLink2Description: https://datasheet.ciiva.com/10033/20021121-10033355.pdf?src-supplier=Avnet; Supplier Part Number 1: 20021121-00020T1LF
M1 = RE1C002UNTCL: as M2 on sheet BG1094_TopLevel; Supplier 1: Digi-Key; Manufacturer Part Number 1: RE1C002UNTCL; Stock 1: 941425; Pricing 1: 1=0.20000, 10=0.18200, 100=0.09930, 500=0.06112, 1000=0.04167 (USD); RoHS: Yes; Mount: Surface Mount; Case/Package: SOT-89; Packaging: Tape and Reel; Drain to Source Voltage (Vdss): 20V; Lead Free: Lead Free; ComponentLink1URL: http://www.mouser.com/ds/2/348/re1c002untcl-e-1018231.pdf?src-supplier=Mouser; ComponentLink1Description: http://www.mouser.com/ds/2/348/re1c002untcl-e-1018231.pdf?src-supplier=Mouser; ComponentLink2URL: http://rohmfs.rohm.com/en/techdata_basic/transistor/taping/EMT3_TL_taping.pdf?src-supplier=Digi-Key; ComponentLink2Description: http://rohmfs.rohm.com/en/techdata_basic/transistor/taping/EMT3_TL_taping.pdf?src-supplier=Digi-Key; ComponentLink3URL: http://rohmfs.rohm.com/en/products/databook/datasheet/discrete/transistor/mosfet/re1c002un.pdf?src-supplier=Avnet; ComponentLink3Description: http://rohmfs.rohm.com/en/products/databook/datasheet/discrete/transistor/mosfet/re1c002un.pdf?src-supplier=Avnet; ComponentLink4URL: https://www.rohm.com/datasheet/RE1C002UN/re1c002untcl-e?src-supplier=Digi-Key; ComponentLink4Description: https://www.rohm.com/datasheet/RE1C002UN/re1c002untcl-e?src-supplier=Digi-Key; ComponentLink5URL: http://www.farnell.com/datasheets/2704376.pdf?src-supplier=Newark; ComponentLink5Description: http://www.farnell.com/datasheets/2704376.pdf?src-supplier=Newark
R1 R5 = !RES
TP2 = TEST_POINT
TP4 TP6 = TP_SMD: circular pad test point, SMD
Z1 = BW1099_Footprint: Use for aligning BW1099 mount

## Sheet BG1094_MIPI_CAM.SchDoc: =project_title
size Tabloid; PageSetup: Record=PageOptions|CenterHorizontal=True|CenterVertical=True|PrintScale=0.73|XCorrection=1.00|YCorrection=1.00|PrintKind=0|BorderSize=5000000|LeftOffset=0|BottomOffset=0|Orientation=2|PaperLength=1000|PaperWidth=1000|Scale=100|PaperSource=7|PrintQuality=-4|MediaType=1|DitherType=10|PaperKind=A4|PrintScaleMode=1; CompanyName: Luxonis Holding; DrawnBy: Brian Weinstein; Organization: Luxonis Holding; Address1: 1925 Harmony Park Drive; Address2: Westminster, CO; Address3: 80234; Address4: United States; DocumentNumber: D0000194; Revision: R1M1E1; SheetNumber: 2; SheetTotal: 5
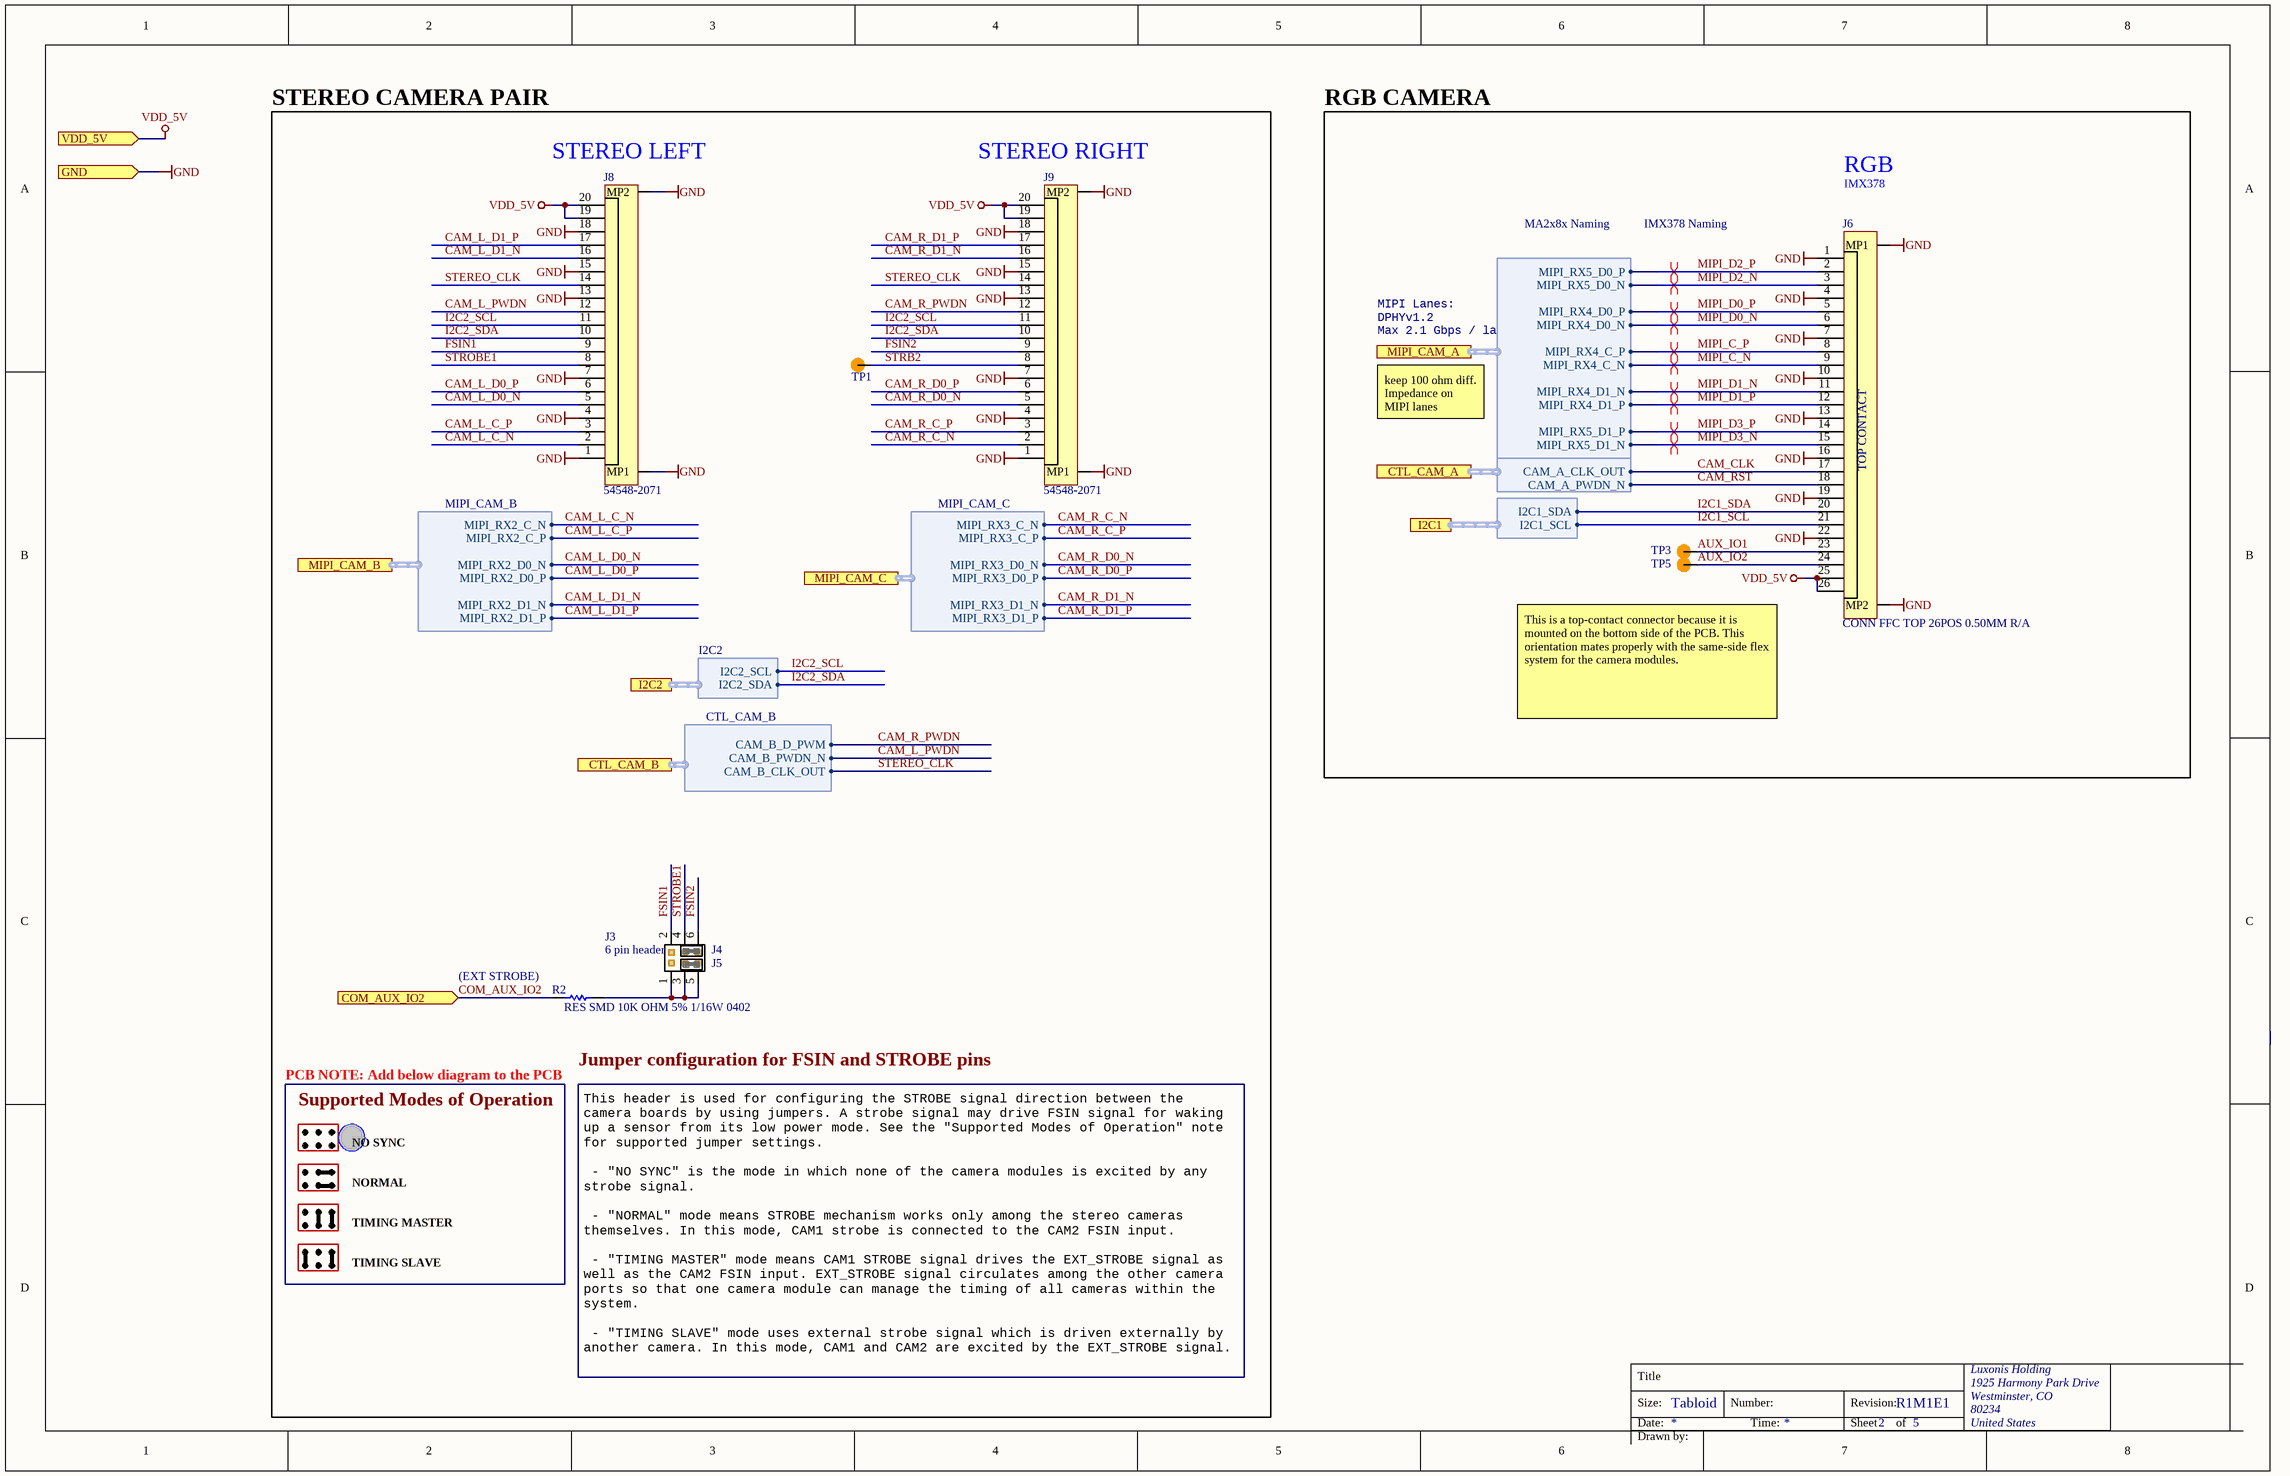
[diagram p2: BG1094_MIPI_CAM.SchDoc]

### Parts
J3  6 pin header  [con-20021121-00006C4LF]
J4  1.27mm hdr shunt  [HDR_SHUNT_1.27MM]  (value not drawn)
J5  1.27mm hdr shunt  [HDR_SHUNT_1.27MM]  (value not drawn)
J6  CONN FFC TOP 26POS 0.50MM R/A  [54550-2671]
J8  54548-2071  [545482071]
J9  54548-2071  [545482071]
R2  RES SMD 10K OHM 5% 1/16W 0402  [RESC0402(1005)_N]
TP1  TP_SMD  [TP_0.75MM_SMD_NO-SILK]  (value not drawn)  (no BOM)
TP3  TP100_200_NS  [TP100_200_NS]  (value not drawn)  (no BOM)
TP5  TP100_200_NS  [TP100_200_NS]  (value not drawn)  (no BOM)

### Ports
COM_AUX_IO2 (in), CTL_CAM_A (harness CTL_CAM_A), CTL_CAM_B (harness CTL_CAM_B), GND (in), I2C1 (harness I2C1), I2C2 (harness I2C2), MIPI_CAM_A (harness MIPI_CAM_A), MIPI_CAM_B (harness MIPI_CAM_B), MIPI_CAM_C (harness MIPI_CAM_C), VDD_5V (in)

### Harnesses
MIPI_CAM_B: MIPI_RX2_C_P, MIPI_RX2_C_N, MIPI_RX2_D0_P, MIPI_RX2_D0_N, MIPI_RX2_D1_P, MIPI_RX2_D1_N
I2C2: I2C2_SDA, I2C2_SCL
I2C1: I2C1_SDA, I2C1_SCL
MIPI_CAM_A: MIPI_RX5_D0_P, MIPI_RX5_D0_N, MIPI_RX4_D0_P, MIPI_RX4_D0_N, MIPI_RX4_C_P, MIPI_RX4_C_N, MIPI_RX4_D1_N, MIPI_RX4_D1_P, MIPI_RX5_D1_P, MIPI_RX5_D1_N
MIPI_CAM_C: MIPI_RX3_C_P, MIPI_RX3_C_N, MIPI_RX3_D0_P, MIPI_RX3_D0_N, MIPI_RX3_D1_P, MIPI_RX3_D1_N
CTL_CAM_A: CAM_A_PWDN_N, CAM_A_CLK_OUT
CTL_CAM_B: CAM_B_CLK_OUT, CAM_B_PWDN_N, CAM_B_D_PWM

### Nets
GND: J6.1 J6.4 J6.7 J6.10 J6.13 J6.16 J6.19 J6.22 J6.MP1 J6.MP2 J8.1 J8.4 J8.7 J8.13 J8.15 J8.18 J8.MP1 J8.MP2 J9.1 J9.4 J9.7 J9.13 J9.15 J9.18 J9.MP1 J9.MP2 ; port GND
VDD_5V: J6.25 J6.26 J8.19 J8.20 J9.19 J9.20 ; port VDD_5V
AUX_IO1: J6.23 TP3.1
AUX_IO2: J6.24 TP5.1
CAM_CLK: J6.17 ; port CTL_CAM_A.CAM_A_CLK_OUT  [project net CAM_A_CLK_OUT]
CAM_L_C_N: J8.2 ; port MIPI_CAM_B.MIPI_RX2_C_N
CAM_L_C_P: J8.3 ; port MIPI_CAM_B.MIPI_RX2_C_P
CAM_L_D0_N: J8.5 ; port MIPI_CAM_B.MIPI_RX2_D0_N
CAM_L_D0_P: J8.6 ; port MIPI_CAM_B.MIPI_RX2_D0_P
CAM_L_D1_N: J8.16 ; port MIPI_CAM_B.MIPI_RX2_D1_N
CAM_L_D1_P: J8.17 ; port MIPI_CAM_B.MIPI_RX2_D1_P
CAM_L_PWDN: J8.12 ; port CTL_CAM_B.CAM_B_PWDN_N  [project net CAM_B_PWDN_N]
CAM_R_C_N: J9.2 ; port MIPI_CAM_C.MIPI_RX3_C_N
CAM_R_C_P: J9.3 ; port MIPI_CAM_C.MIPI_RX3_C_P
CAM_R_D0_N: J9.5 ; port MIPI_CAM_C.MIPI_RX3_D0_N
CAM_R_D0_P: J9.6 ; port MIPI_CAM_C.MIPI_RX3_D0_P
CAM_R_D1_N: J9.16 ; port MIPI_CAM_C.MIPI_RX3_D1_N
CAM_R_D1_P: J9.17 ; port MIPI_CAM_C.MIPI_RX3_D1_P
CAM_R_PWDN: J9.12 ; port CTL_CAM_B.CAM_B_D_PWM  [project net CAM_B_D_PWM]
CAM_RST: J6.18 ; port CTL_CAM_A.CAM_A_PWDN_N  [project net CAM_A_PWDN_N]
COM_AUX_IO2: R2.1 ; port COM_AUX_IO2
FSIN1: J3.2 J8.9
FSIN2: J3.6 J9.9
I2C1_SCL: J6.21 ; port I2C1.I2C1_SCL
I2C1_SDA: J6.20 ; port I2C1.I2C1_SDA
I2C2_SCL: J8.11 J9.11 ; port I2C2.I2C2_SCL
I2C2_SDA: J8.10 J9.10 ; port I2C2.I2C2_SDA
MIPI_C_N: J6.9 ; port MIPI_CAM_A.MIPI_RX4_C_N
MIPI_C_P: J6.8 ; port MIPI_CAM_A.MIPI_RX4_C_P
MIPI_D0_N: J6.6 ; port MIPI_CAM_A.MIPI_RX4_D0_N
MIPI_D0_P: J6.5 ; port MIPI_CAM_A.MIPI_RX4_D0_P
MIPI_D1_N: J6.11 ; port MIPI_CAM_A.MIPI_RX4_D1_N
MIPI_D1_P: J6.12 ; port MIPI_CAM_A.MIPI_RX4_D1_P
MIPI_D2_N: J6.3 ; port MIPI_CAM_A.MIPI_RX5_D0_N
MIPI_D2_P: J6.2 ; port MIPI_CAM_A.MIPI_RX5_D0_P
MIPI_D3_N: J6.15 ; port MIPI_CAM_A.MIPI_RX5_D1_N
MIPI_D3_P: J6.14 ; port MIPI_CAM_A.MIPI_RX5_D1_P
STEREO_CLK: J8.14 J9.14 ; port CTL_CAM_B.CAM_B_CLK_OUT  [project net CAM_B_CLK_OUT]
STRB2: J9.8 TP1.1
STROBE1: J3.4 J8.8
NetJ3_1: J3.1 J3.3 J3.5 R2.2

### Layout directives
differential pair: MIPI_C_N, MIPI_C_P, MIPI_D0_N, MIPI_D0_P, MIPI_D1_N, MIPI_D1_P, MIPI_D2_N, MIPI_D2_P, MIPI_D3_N, MIPI_D3_P

### Notes on the sheet
- STEREO CAMERA PAIR
- (near J8) STEREO LEFT
- (near J9) STEREO RIGHT
- RGB CAMERA
- MA2x8x Naming
- IMX378 Naming
- RGB
- IMX378
- MIPI Lanes:
- Max 2.1 Gbps / lane
- DPHYv1.2
- keep 100 ohm diff. Impedance on MIPI lanes
- This is a top-contact connector because it is mounted on the bottom side of the PCB. This orientation mates properly with the same-side flex system for the camera modules.
- (near R2) (EXT STROBE)
- PCB NOTE: Add below diagram to the PCB
- Jumper configuration for FSIN and STROBE pins
- Supported Modes of Operation
- NO SYNC
- NORMAL
- TIMING MASTER
- TIMING SLAVE
- This header is used for configuring the STROBE signal direction between the camera boards by using jumpers. A strobe signal may drive FSIN signal for waking up a sensor from its low power mode. See the "Supported Modes of Operation" note for supported jumper settings.
  - "NO SYNC" is the mode in which none of the camera modules is excited by any strobe signal.
  - "NORMAL" mode means STROBE mechanism works only among the stereo cameras themselves. In this mode, CAM1 strobe is connected to the CAM2 FSIN input.
  - "TIMING MASTER" mode means CAM1 STROBE signal drives the EXT_STROBE signal as well as the CAM2 FSIN input. EXT_STROBE signal circulates among the other camera ports so that one camera module can manage the timing of all cameras within the system.
  - "TIMING SLAVE" mode uses external strobe signal which is driven externally by another camera. In this mode, CAM1 and CAM2 are excited by the EXT_STROBE signal.
  Note that, at most only one camera can be in the "TIMING MASTER" mode at a time. STROBE generation and FSIN reception should be configured via software.
- Title
- Size:
- Date:
- Tabloid
- Number:
- Time:
- Revision:
- Sheet
- of
- Drawn by:
- (in symbol 54550-2671) TOP CONTACT

### Library data of the parts
J3 = HDR_2x3_1.27mm
J4 J5 = HDR_Shunt_1.27mm: CONN SHUNT 1.27MM BLACK (M50-1900005); Manufacturer 1: Harwin; Manufacturer Part Number 1: M50-1900005
J6 = 54550-2671: Manufacturer 1: Molex; Actuator Material: Polyphenylene; Current Rating: 500mA; Voltage Rating: 50V; Contact Resistance: 40mR; Number of Positions: 26; Wire/Cable Type: Straight; Mating Cycles: 20; Pitch: 0.5mm; Supplier 1: Digi-Key; Manufacturer Part Number 1: 54550-2671; Stock 1: 6245; Pricing 1: 1=2.84000, 10=2.72700, 25=2.50000, 50=2.38620, 100=2.27260, 250=1.98852 (USD); RoHS: Yes; Mount: Surface Mount; Contact Material: Bronze; Contact Plating: Gold; Housing Material: Polymer; Housing Color: Natural; Min Operating Temperature: -20°C; Max Operating Temperature: 85°C; Packaging: Tape and Reel; Package Quantity: 750; Number of Rows: 1; Termination: Solder; Number of Contacts: 26; Orientation: Right Angle; Length: 18.2mm; Depth: 5mm; Flammability Rating: UL94 V-0; ComponentLink1URL: https://datasheet.ciiva.com/5136/0545502671-ffc-fpc-connectors-228748-5136548.pdf?src-supplier=Mouser; ComponentLink1Description: https://datasheet.ciiva.com/5136/0545502671-ffc-fpc-connectors-228748-5136548.pdf?src-supplier=Mouser; ComponentLink2URL: https://datasheet.ciiva.com/3925/24240545502671-ffc-fpc-nectors-3925432.pdf?src-supplier=Arrow; ComponentLink2Description: https://datasheet.ciiva.com/3925/24240545502671-ffc-fpc-nectors-3925432.pdf?src-supplier=Arrow; ComponentLink3URL: https://datasheet.ciiva.com/16659/0545502671-ffc-fpc-connectors-16659849.pdf?src-supplier=Avnet+Europe; ComponentLink3Description: https://datasheet.ciiva.com/16659/0545502671-ffc-fpc-connectors-16659849.pdf?src-supplier=Avnet+Europe; ComponentLink4URL: https://datasheet.ciiva.com/15177/getdatasheetpartid-704282-15177102.pdf?src-supplier=Verical; ComponentLink4Description: https://datasheet.ciiva.com/15177/getdatasheetpartid-704282-15177102.pdf?src-supplier=Verical; ComponentLink5URL: https://datasheet.ciiva.com/15245/285330545502671-ffc-fpc-nectors-15245807.pdf?src-supplier=Arrow+Europe; ComponentLink5Description: https://datasheet.ciiva.com/15245/285330545502671-ffc-fpc-nectors-15245807.pdf?src-supplier=Arrow+Europe; ComponentLink6URL: https://datasheet.ciiva.com/10366/0545502671-ffc-fpc-connectors-10366875.pdf?src-supplier=Avnet; ComponentLink6Description: https://datasheet.ciiva.com/10366/0545502671-ffc-fpc-connectors-10366875.pdf?src-supplier=Avnet; Supplier 2: Digi-Key; Supplier 3: Mouser; Supplier 4: Arrow; Supplier Part Number 1: WM8809CT-ND; Supplier Part Number 2: WM8809TR-ND; Supplier Part Number 3: 538-54550-2671; Supplier Part Number 4: 54550-2671
J8 J9 = 54548-2071: FFC & FPC Connectors 0.5 FPC ZIF Hsg Assy ssy 20Ckt EmbsTp Pkg; Manufacturer_Name: Molex; Manufacturer_Part_Number: 54548-2271; Datasheet Link: http://www.molex.com/webdocs/datasheets/pdf/en-us//0545482271_FFC_FPC_CONNECTORS.pdf; Height: 1mm; Mouser Part Number: 538-54548-2271; Mouser Price/Stock: https://www.mouser.com/Search/Refine.aspx?Keyword=538-54548-2271
R2 = !RES
TP1 = TP_SMD: circular pad test point, SMD
TP3 TP5 = TEST_POINT

## Sheet BG1094_USB.SchDoc: =project_title
size Tabloid; PageSetup: Record=PageOptions|CenterHorizontal=True|CenterVertical=True|PrintScale=0.73|XCorrection=1.00|YCorrection=1.00|PrintKind=0|BorderSize=5000000|LeftOffset=0|BottomOffset=0|Orientation=2|PaperLength=1000|PaperWidth=1000|Scale=100|PaperSource=7|PrintQuality=-4|MediaType=1|DitherType=10|PaperKind=A4|PrintScaleMode=1; CompanyName: Luxonis Holding; DrawnBy: Brian Weinstein; Organization: Luxonis Holding; Address1: 1925 Harmony Park Drive; Address2: Westminster, CO; Address3: 80234; Address4: United States; DocumentNumber: D0000194; Revision: R1M1E1; SheetNumber: 4; SheetTotal: 5
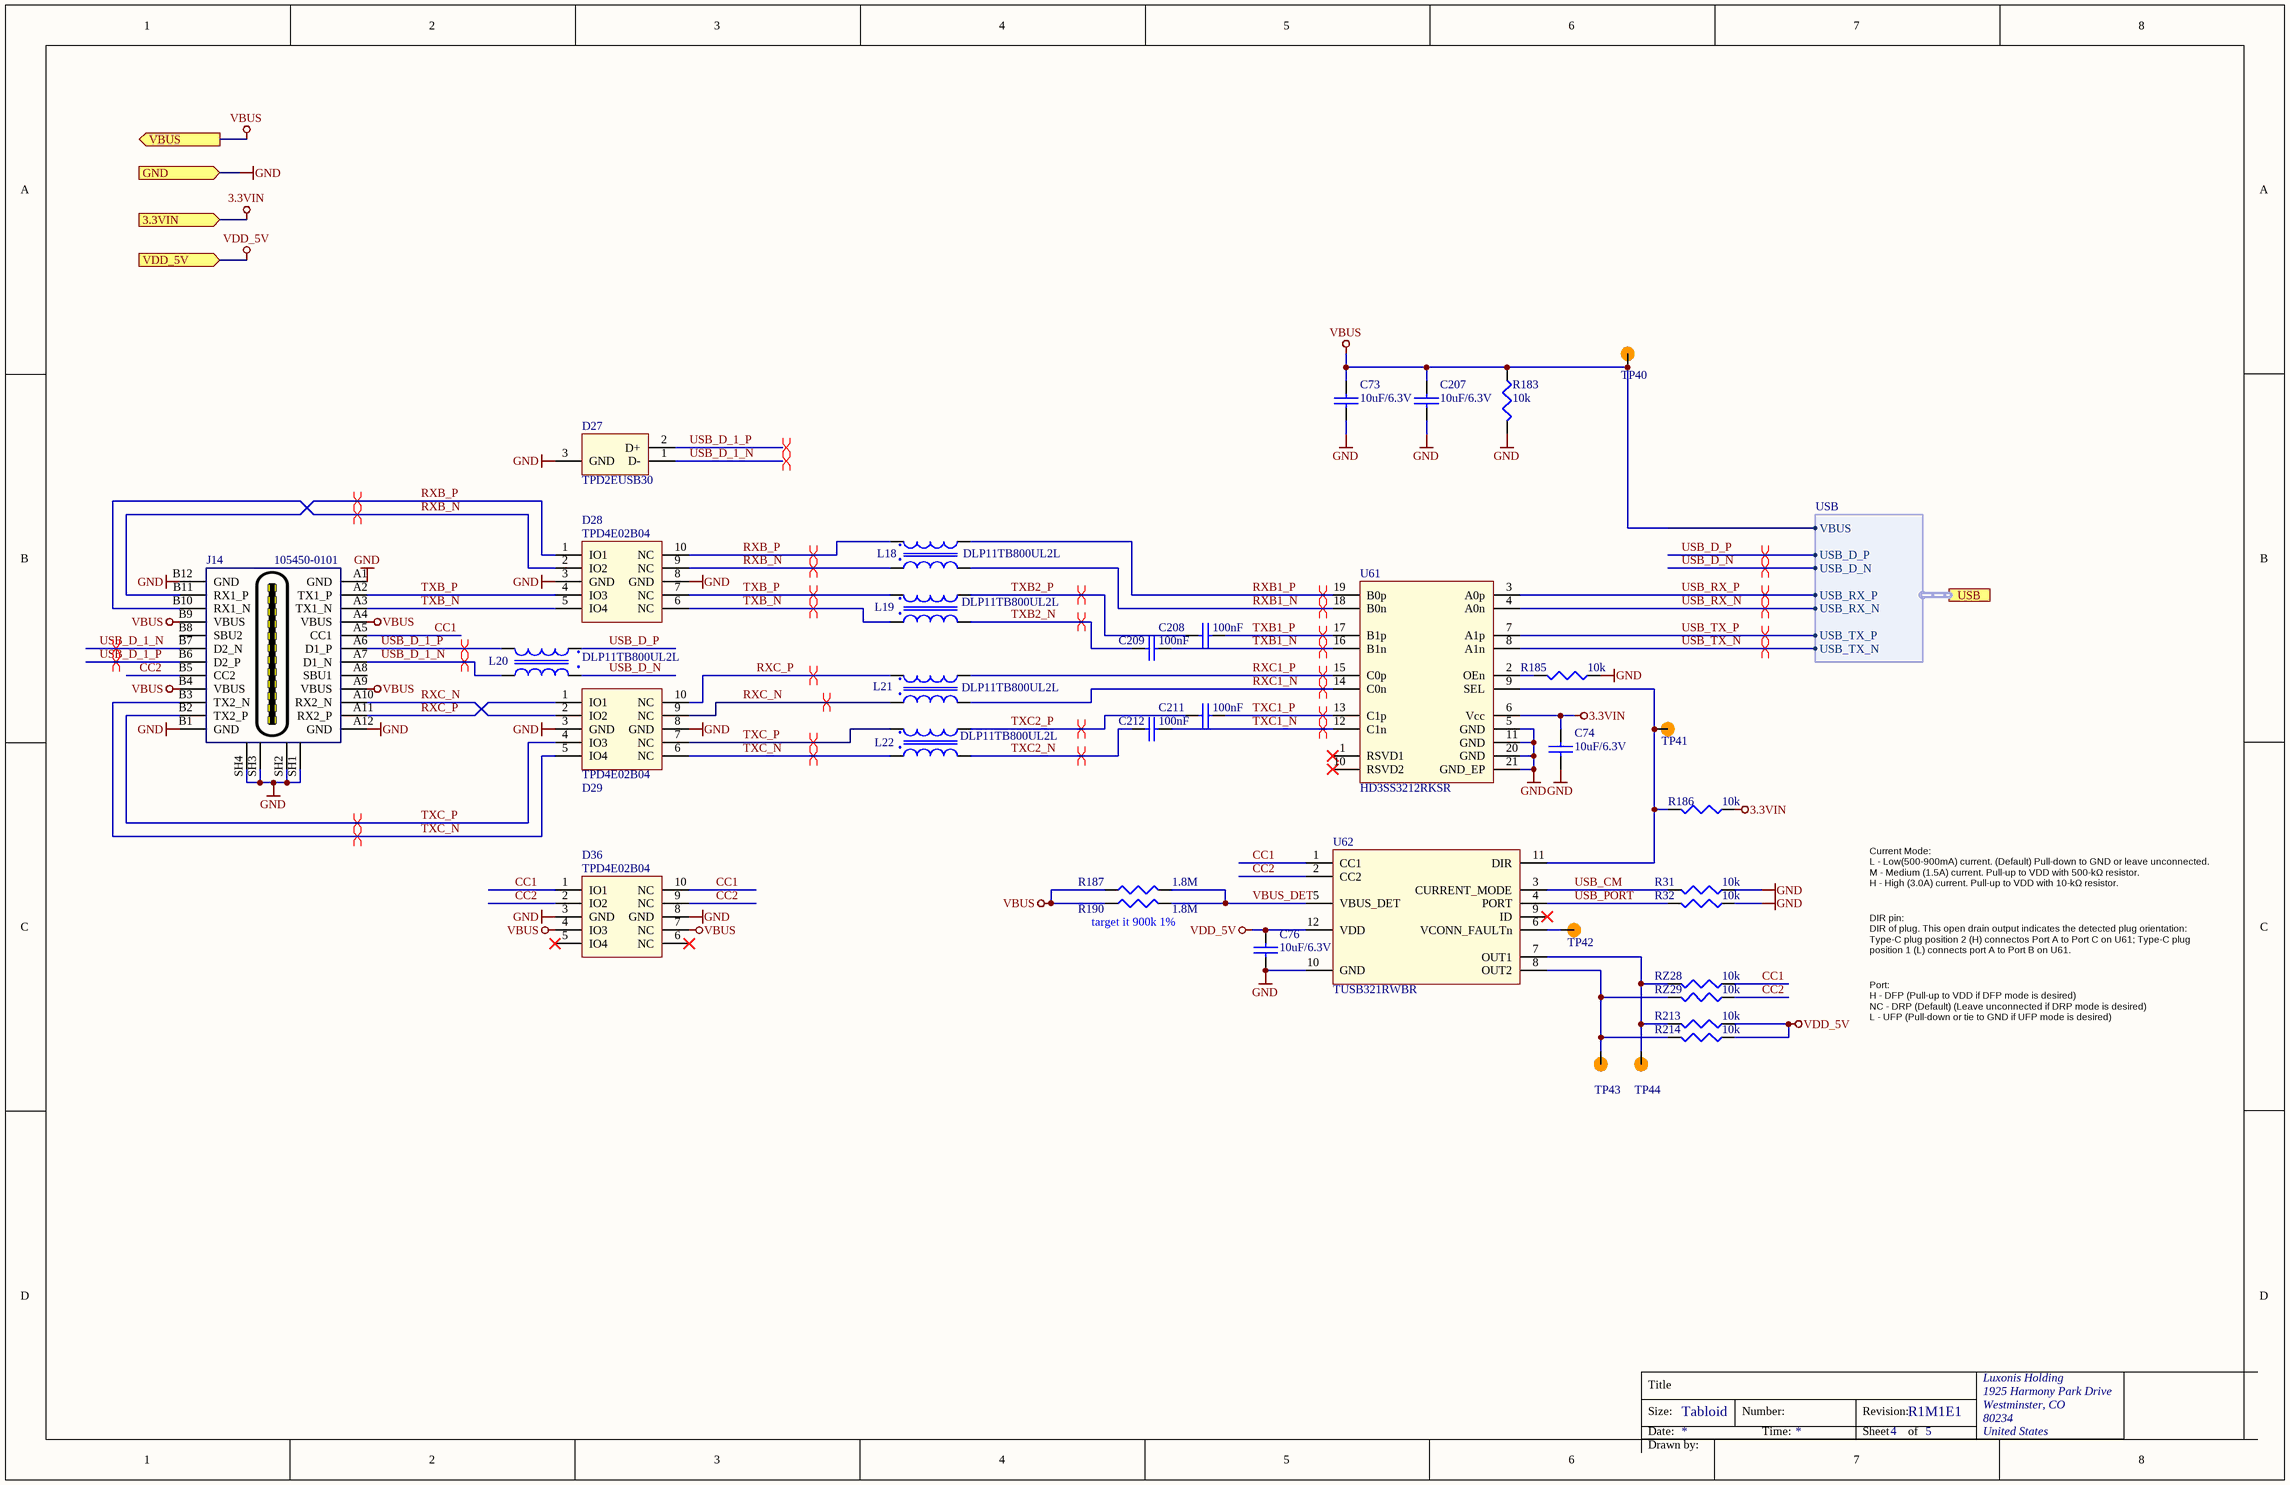
[diagram p3: BG1094_USB.SchDoc]

### Parts
C73  10uF/6.3V  [CAPC0402(1005)70_N]
C74  10uF/6.3V  [CAPC0402(1005)70_N]
C76  10uF/6.3V  [CAPC0402(1005)70_N]
C207  10uF/6.3V  [CAPC0402(1005)70_N]
C208  100nF  [CAPC0201(0603)33_L]
C209  100nF  [CAPC0201(0603)33_L]
C211  100nF  [CAPC0201(0603)33_L]
C212  100nF  [CAPC0201(0603)33_L]
D27  TPD2EUSB30  [SOT-3]
D28  TPD4E02B04  [DQA-10]
D29  TPD4E02B04  [DQA-10]
D36  TPD4E02B04  [DQA-10]
J14  105450-0101  [Molex_105450-0101]
L18  DLP11TB800UL2L  [CHOKE_0504]
L19  DLP11TB800UL2L  [CHOKE_0504]
L20  DLP11TB800UL2L  [CHOKE_0504]
L21  DLP11TB800UL2L  [CHOKE_0504]
L22  DLP11TB800UL2L  [CHOKE_0504]
R31  10k  [RESC0402(1005)_N]
R32  10k  [RESC0402(1005)_N]
R183  10k  [RESC0402(1005)_N]
R185  10k  [RESC0402(1005)_N]
R186  10k  [RESC0402(1005)_N]
R187  1.8M  [RESC0402(1005)_N]
R190  1.8M  [RESC0402(1005)_N]
R213  10k  [RESC0402(1005)_N]
R214  10k  [RESC0402(1005)_N]
RZ28  10k  [RESC0402(1005)_N]
RZ29  10k  [RESC0402(1005)_N]
TP40  TP_SMD  [TP_0.75MM_SMD_NO-SILK]  (value not drawn)  (no BOM)
TP41  TP_SMD  [TP_0.75MM_SMD_NO-SILK]  (value not drawn)  (no BOM)
TP42  TP_SMD  [TP_0.75MM_SMD_NO-SILK]  (value not drawn)  (no BOM)
TP43  TP_SMD  [TP_0.75MM_SMD_NO-SILK]  (value not drawn)  (no BOM)
TP44  TP_SMD  [TP_0.75MM_SMD_NO-SILK]  (value not drawn)  (no BOM)
U61  HD3SS3212RKSR  [VQFN-20]
U62  TUSB321RWBR  [X2QFN-12]

### Ports
3.3VIN (in), GND (in), USB (harness USB), VBUS (out), VDD_5V (in)

### Harnesses
USB: VBUS, USB_D_P, USB_D_N, USB_TX_N, USB_TX_P, USB_RX_N, USB_RX_P

### Nets
3.3VIN: C74.2 R186.2 U61.6(Vcc) ; port 3.3VIN
GND: C73.1 C74.1 C76.1 C207.1 D27.3(GND) D28.3(GND) D28.8(GND) D29.3(GND) D29.8(GND) D36.3(GND) D36.8(GND) J14.A1(GND) J14.A12(GND) J14.B1(GND) J14.B12(GND) J14.SH1(SH) J14.SH2(SH) J14.SH3(SH) J14.SH4(SH) R31.2 R32.2 R183.1 R185.2 U61.5(GND) U61.11(GND) U61.20(GND) U61.21(GND_EP) U62.10(GND) ; port GND
VBUS: C73.2 C207.2 D36.4(IO3) D36.7(NC) J14.A4(VBUS) J14.A9(VBUS) J14.B4(VBUS) J14.B9(VBUS) R183.2 R187.2 R190.2 TP40.1 ; port VBUS, port USB.VBUS
VDD_5V: C76.2 R213.2 R214.2 U62.12(VDD) ; port VDD_5V
CC1: D36.1(IO1) D36.10(NC) J14.A5(CC1) RZ28.1 U62.1(CC1)
CC2: D36.2(IO2) D36.9(NC) J14.B5(CC2) RZ29.1 U62.2(CC2)
RXB1_N: L18.4 U61.18(B0n)
RXB1_P: L18.2 U61.19(B0p)
RXB_N: D28.2(IO2) D28.9(NC) J14.B10(RX1_N) L18.3
RXB_P: D28.1(IO1) D28.10(NC) J14.B11(RX1_P) L18.1
RXC1_N: L21.4 U61.14(C0n)
RXC1_P: L21.2 U61.15(C0p)
RXC_N: D29.2(IO2) D29.9(NC) J14.A10(RX2_N) L21.3
RXC_P: D29.1(IO1) D29.10(NC) J14.A11(RX2_P) L21.1
TXB1_N: C209.1 U61.16(B1n)
TXB1_P: C208.1 U61.17(B1p)
TXB2_N: C209.2 L19.4
TXB2_P: C208.2 L19.2
TXB_N: D28.5(IO4) D28.6(NC) J14.A3(TX1_N) L19.3
TXB_P: D28.4(IO3) D28.7(NC) J14.A2(TX1_P) L19.1
TXC1_N: C212.1 U61.12(C1n)
TXC1_P: C211.1 U61.13(C1p)
TXC2_N: C212.2 L22.4
TXC2_P: C211.2 L22.2
TXC_N: D29.5(IO4) D29.6(NC) J14.B3(TX2_N) L22.3
TXC_P: D29.4(IO3) D29.7(NC) J14.B2(TX2_P) L22.1
USB_CM: R31.1 U62.3(CURRENT_MODE)
USB_D_1_N: D27.1(D-) J14.A7(D1_N) J14.B7(D2_N) L20.4
USB_D_1_P: D27.2(D+) J14.A6(D1_P) J14.B6(D2_P) L20.2
USB_D_N: L20.3 ; port USB.USB_D_N
USB_D_P: L20.1 ; port USB.USB_D_P
USB_PORT: R32.1 U62.4(PORT)
USB_RX_N: U61.4(A0n) ; port USB.USB_RX_N
USB_RX_P: U61.3(A0p) ; port USB.USB_RX_P
USB_TX_N: U61.8(A1n) ; port USB.USB_TX_N
USB_TX_P: U61.7(A1p) ; port USB.USB_TX_P
VBUS_DET: R187.1 R190.1 U62.5(VBUS_DET)
NetR185_1: R185.1 U61.2(OEn)
NetR186_1: R186.1 TP41.1 U61.9(SEL) U62.11(DIR)
NetR213_1: R213.1 RZ28.2 TP44.1 U62.7(OUT1)
NetR214_1: R214.1 RZ29.2 TP43.1 U62.8(OUT2)
NetTP42_1: TP42.1 U62.6(VCONN_FAULTn)

Not connected (* = marked no-connect by the designer): D36 5(IO4)* 6(NC)*; J14 A8(SBU1) B8(SBU2); U61 1(RSVD1)* 10(RSVD2)*; U62 9(ID)*

### Layout directives
differential pair; differential pair class USB3: RXB1_N, RXB1_P, RXB_N, RXB_P, RXC1_N, RXC1_P, RXC_N, RXC_P, TXB1_N, TXB1_P, TXB2_N, TXB2_P, TXB_N, TXB_P, TXC1_N, TXC1_P, TXC2_N, TXC2_P, TXC_N, TXC_P, USB_D_1_N, USB_D_1_P, USB_D_N, USB_D_P, USB_RX_N, USB_RX_P, USB_TX_N, USB_TX_P

### Notes on the sheet
- Current Mode:
  L - Low(500-900mA) current. (Default) Pull-down to GND or leave unconnected.
  M - Medium (1.5A) current. Pull-up to VDD with 500-kΩ resistor.
  H - High (3.0A) current. Pull-up to VDD with 10-kΩ resistor.
- (near R190) target it 900k 1%
- DIR pin:
  DIR of plug. This open drain output indicates the detected plug orientation: Type-C plug position 2 (H) connectos Port A to Port C on U61; Type-C plug position 1 (L) connects port A to Port B on U61.
- Port:
  H - DFP (Pull-up to VDD if DFP mode is desired)
  NC - DRP (Default) (Leave unconnected if DRP mode is desired)
  L - UFP (Pull-down or tie to GND if UFP mode is desired)
- Title
- Size:
- Date:
- Tabloid
- Number:
- Time:
- Revision:
- Sheet
- of
- Drawn by:
- (in symbol DLP11TB800UL2L) .

### Library data of the parts
C73 C74 C76 C207 = CAP: as C1 on sheet BG1094_TopLevel
C208 C209 C211 C212 = CAP: SMD Multilayer Ceramic Capacitor, 0201 [0603 Metric], 0.1 µF, 6.3 V, ± 10%, X5R; B - Value: 0.1uF; C - Notes: 0201  0.1 µF, 6.3 V, ± 10%, X5R; E - MFG: MuRata; F - MFG P/N: GRM033R60J104KE19D; D - my Footprint: CAPC0201(0603)33_L
D27 = TPD2EUSB30: DIODE, ESD, DUAL, USB3.0, SOT-3; E - MFG: TI; F - MFG P/N: TPD2EUSB30ADRTR; D - my Footprint: SOT-3
D28 D29 D36 = TPD4E02B04: TVS DIODE 3.6VWM 8.8VC 10USON; E - MFG: TI; F - MFG P/N: TPD4E02B04DQAR; D - my Footprint: DQA-10
J14 = Molex_1054500101: USB 3.1 Type C Receptacle SMD RA; E - MFG: Molex; D - my Footprint: Molex_105450-0101; F - MFG P/N: 105450-0101
L18-L22 = DLP11TB800UL2L: CMC 150MA 2LN 80 OHM SMD; E - MFG: MuRata; D - my Footprint: CHOKE_0504; F - MFG P/N: DLP11TB800UL2L
R31 R32 R183 R185 R186 R213 R214 RZ28 RZ29 = RES1: SMD Chip Resistor, Thick Film, 10 kohm, 50 V, 0402, 100mW, ± 1%; MAN: Panasonic; MAN PN: ERJ2RKF1002X; ICCO PN: M2V00015; DIST: Farnell; DIST PN: 2397284
R187 R190 = R_1.8M_1%_0402: RES SMD 1.8M 1% 0402 50V; E - MFG: YAGEO (PHYCOMP); F - MFG P/N: RC0402FR-071M8L; D - my Footprint: RESC0402(1005)_N
TP40-TP44 = TP_SMD: circular pad test point, SMD
U61 = HD3SS3212RKSR: Two Channel Differential 2:1/1:2 10Gbps Mux/Demux; E - MFG: TEXAS INSTRUMENTS; D - my Footprint: VQFN-20; F - MFG P/N: HD3SS3212RKSR
U62 = TUSB321RWBR: USB Type-C  ™ Configuration  Channel  Logic and Port Control  with VCONN; E - MFG: TI; D - my Footprint: X2QFN-12; F - MFG P/N: TUSB321RWBR